# EAGLE design octanis_v0.4 (EAGLE 7.2.0)
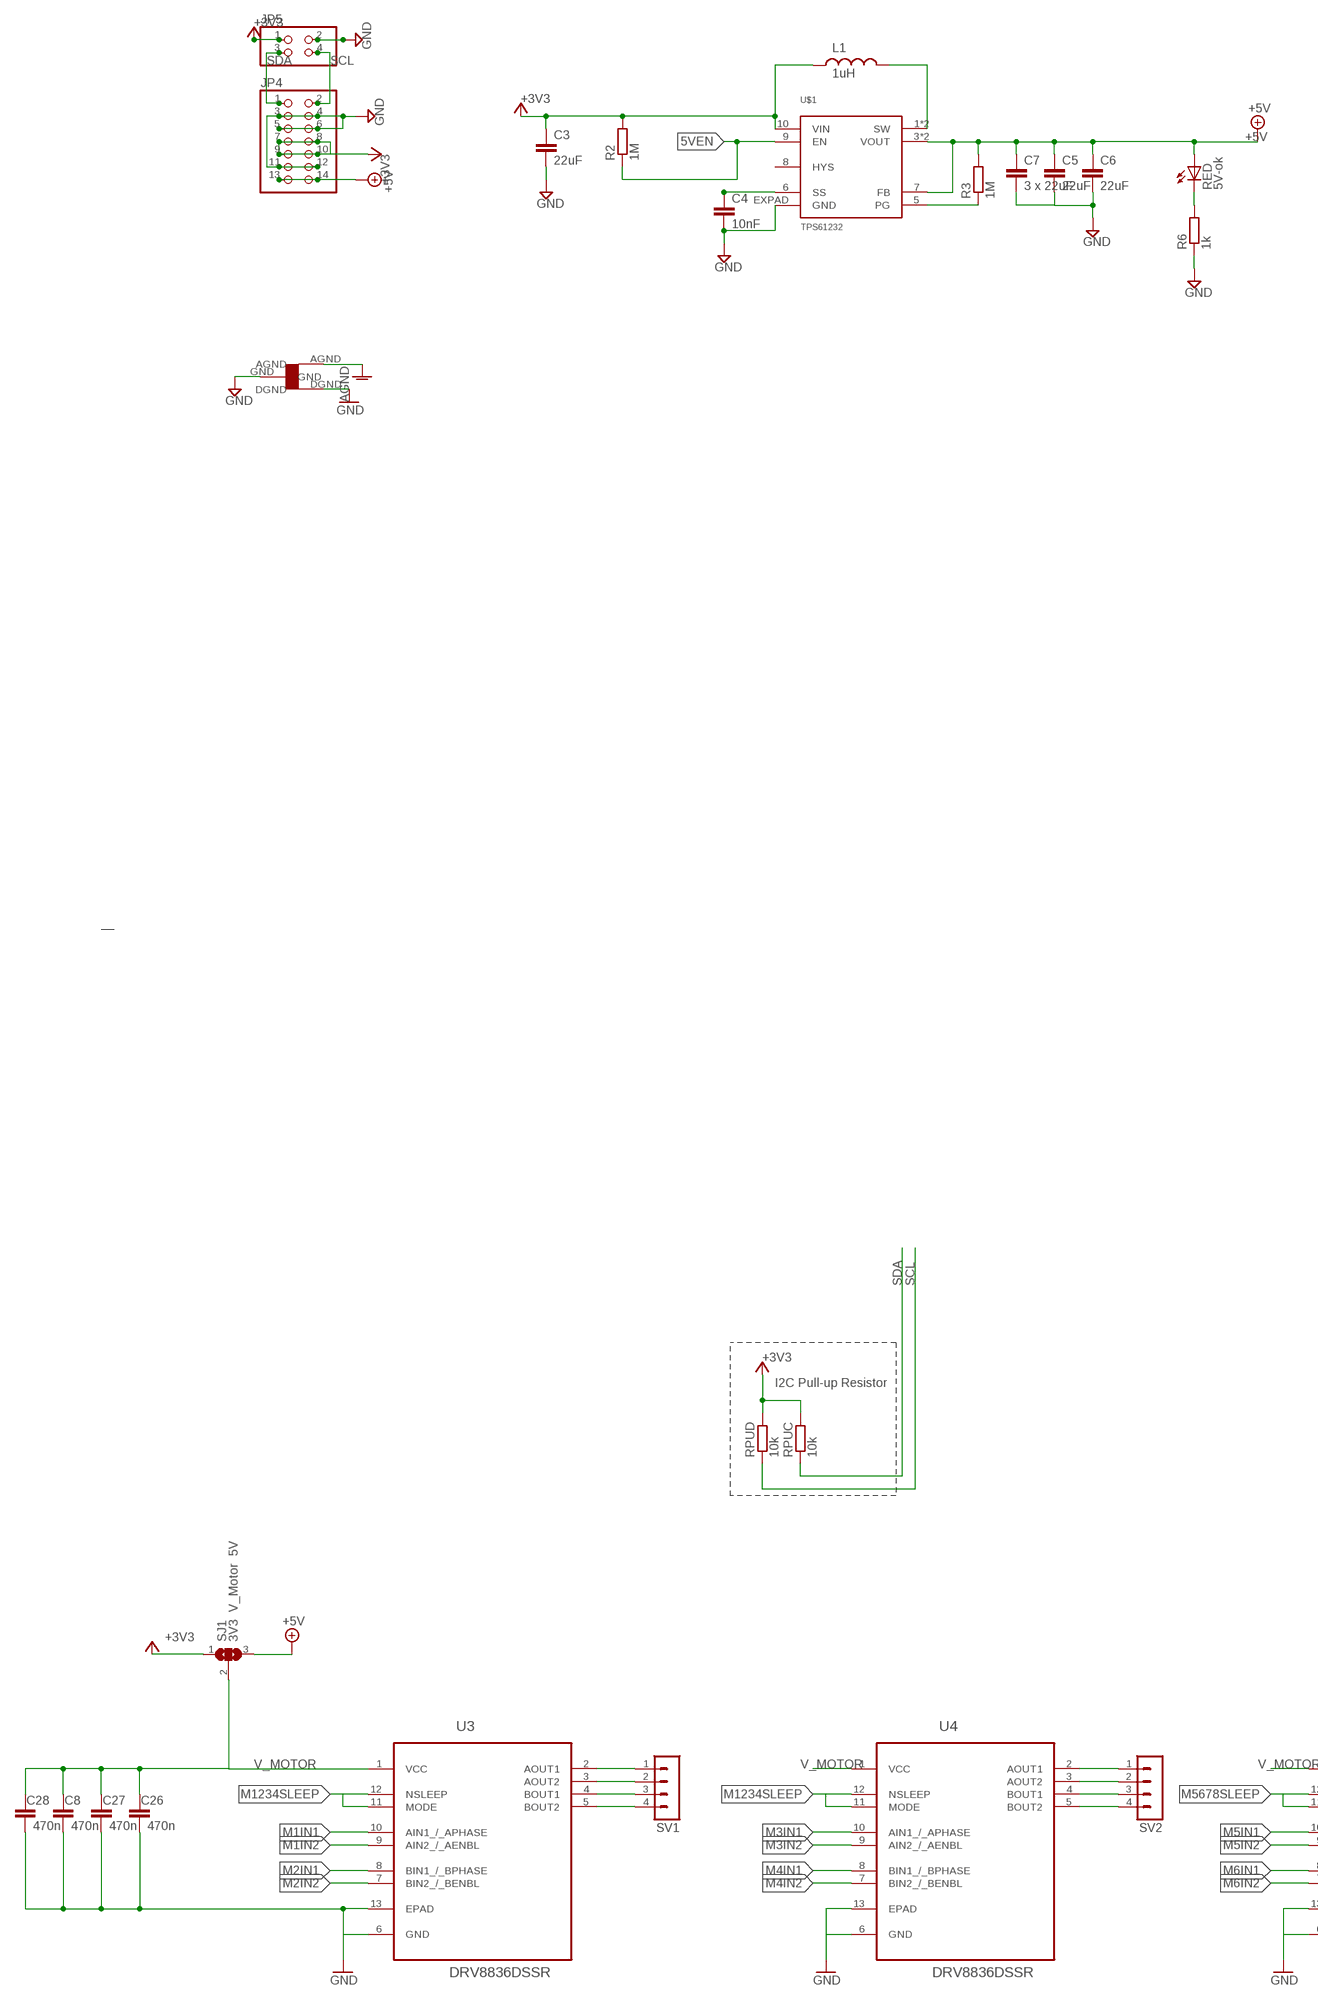
[diagram p0: schematic, sheet 1, part 1 of 3]
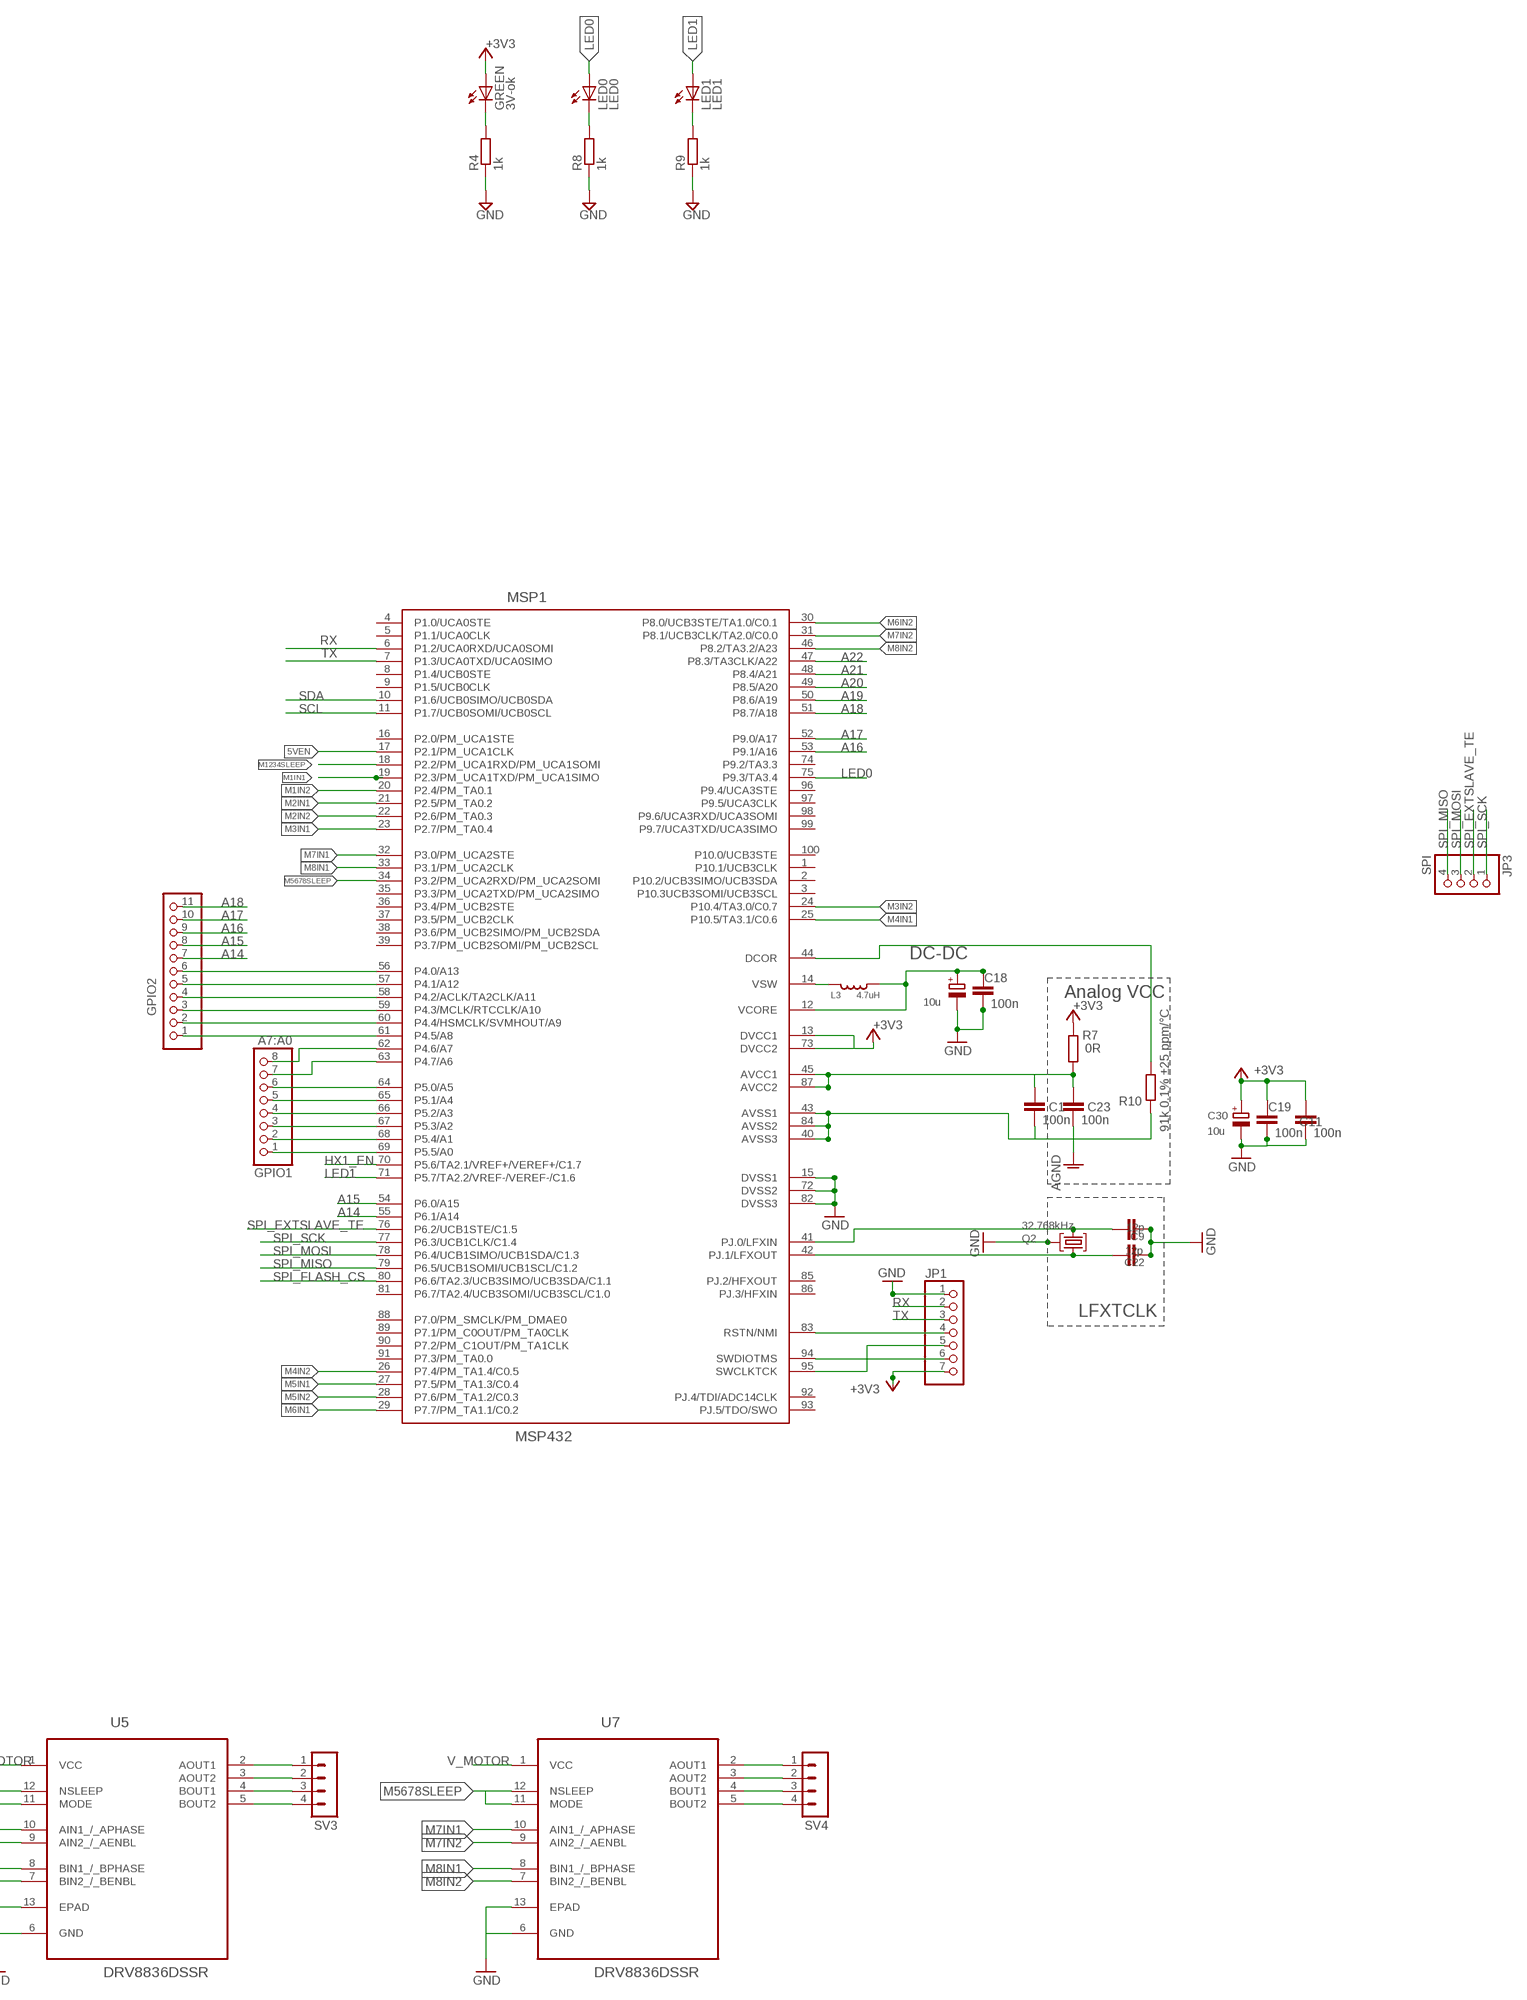
[diagram p1: schematic, sheet 1, part 2 of 3]
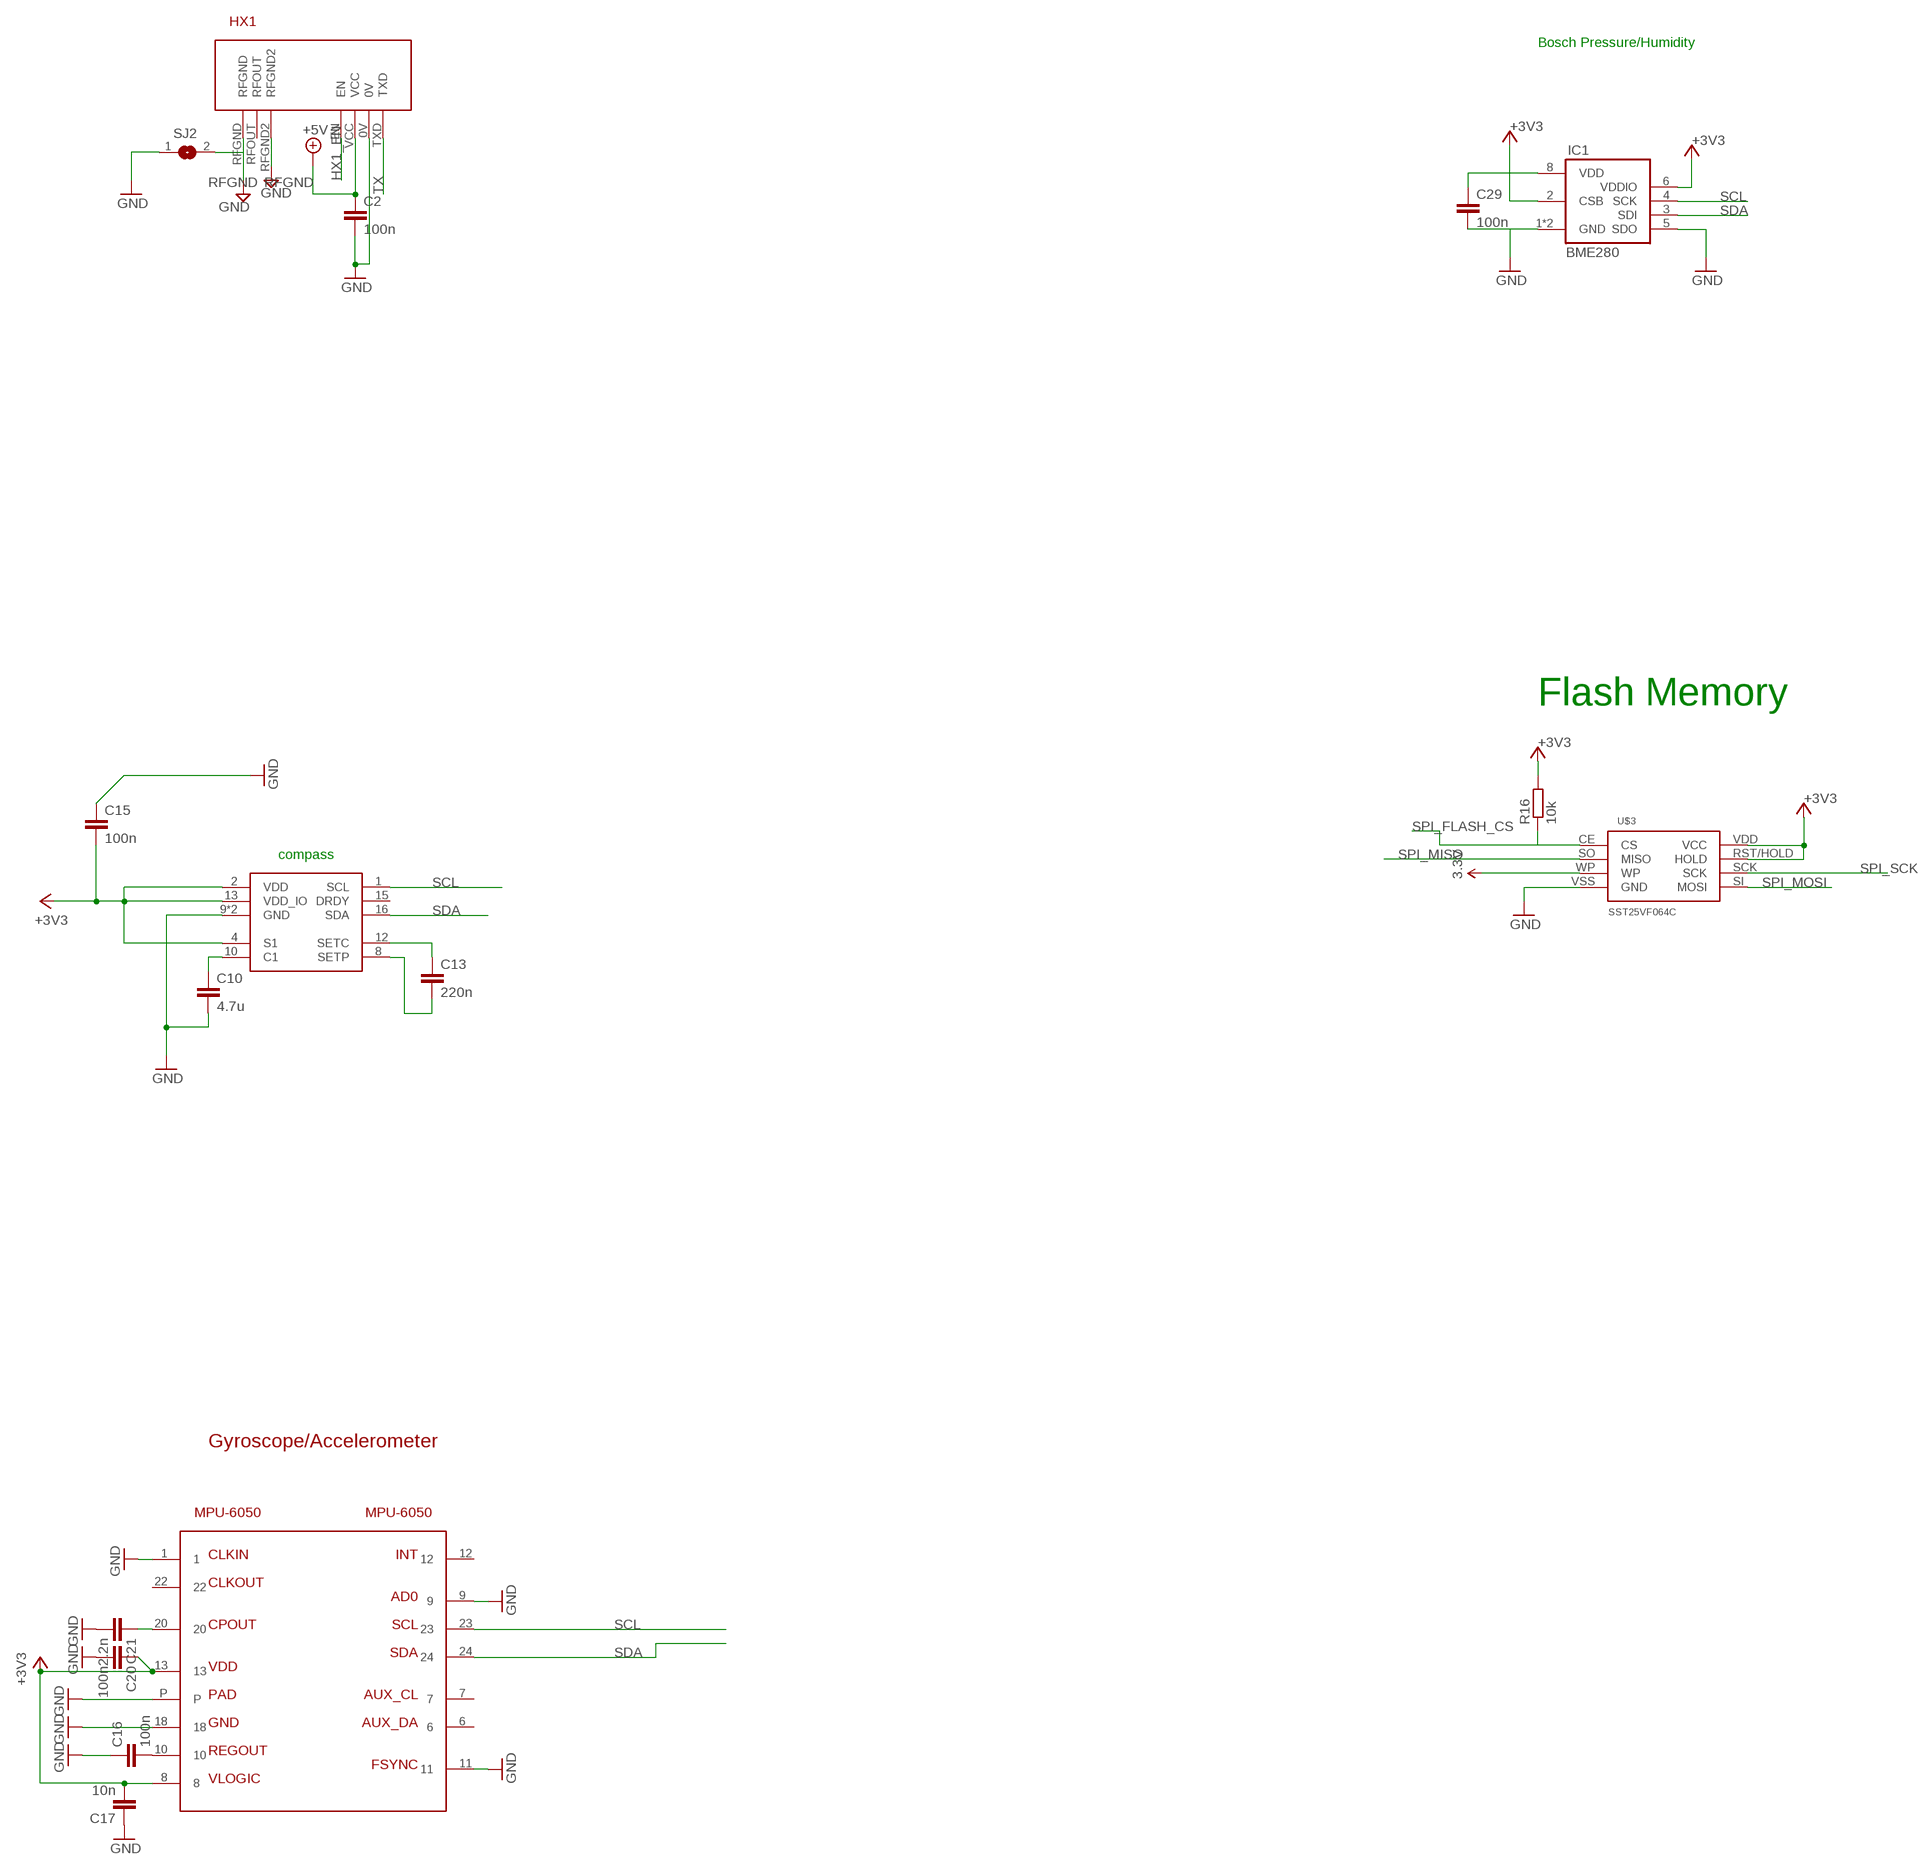
[diagram p2: schematic, sheet 1, part 3 of 3]

## Parts
C1  100n  C-EUC0402  [C0402]
C2  100n  C-EUC0603  [C0603]
C3  22uF  C-EUC0603  [C0603]
C4  10nF  C-EUC0603  [C0603]
C5  22uF  C-EUC0603  [C0603]
C6  22uF  C-EUC0603  [C0603]
C7  3 x 22uF  C-EUC0603  [C0603]
C8  470n  C-EUC0603  [C0603]
C9  12p  C-EUC0402  [C0402]
C10  4.7u  C-EUC0603  [C0603]
C11  100n  C-EUC0603  [C0603]
C13  220n  C-EUC0603  [C0603]
C15  100n  C-EUC0603  [C0603]
C16  100n  C-EUC0603  [C0603]
C17  10n  C-EUC0603  [C0603]
C18  100n  C-EUC0603  [C0603]
C19  100n  C-EUC0603  [C0603]
C20  100n  C-EUC0603  [C0603]
C21  2.2n  C-EUC0603  [C0603]
C22  12p  C-EUC0402  [C0402]
C23  100n  C-EUC0402  [C0402]
C25  10u  CPOL-EUA/3216-18R  [A/3216-18R]
C26  470n  C-EUC0603  [C0603]
C27  470n  C-EUC0603  [C0603]
C28  470n  C-EUC0603  [C0603]
C29  100n  C-EUC0603  [C0603]
C30  10u  CPOL-EUA/3216-18R  [A/3216-18R]
COMPASS  HMC5883L  HMC5883L  [LPCC16]
GPIO1  A7:A0  PINHD-1X8  [1X08]
GPIO2  A18:A8  PINHD-1X11  [1X11]
GREEN  3V-ok  LEDCHIPLED_0603  [CHIPLED_0603]
IC1  BME280  [BME280]
JP1  PINHD-1X72MM  [1:07X2MM]
JP3  SPI  PINHD-1X4  [1X04]
JP4  PINHD-2X7  [2X07]
JP5  PINHD-2X2  [2X02]
L1  1uH  XFL4020  [XFL4020]
L3  4.7uH  LQM2MP_G0  [0806]
LED0  LED0  LEDCHIPLED_0603  [CHIPLED_0603]
LED1  LED1  LEDCHIPLED_0603  [CHIPLED_0603]
MPU-6050  MPU-6050  [QFN24]
MSP1  MSP432  [PZ100]
Q2  32.768kHz  MS3V-T1R  [MS3V-T1R]
R2  1M  R-EU_R0603  [R0603]
R3  1M  R-EU_R0603  [R0603]
R4  1k  R-EU_R0603  [R0603]
R6  1k  R-EU_R0603  [R0603]
R7  0R  R-EU_R0402  [R0402]
R8  1k  R-EU_R0603  [R0603]
R9  1k  R-EU_R0603  [R0603]
R10  91k 0.1% ±25 ppm/°C  R-EU_R0402  [R0402]
R16  10k  R-EU_R0603  [R0603]
RED  5V-ok  LEDCHIPLED_0603  [CHIPLED_0603]
RPUC  10k  R-EU_R0603  [R0603]
RPUD  10k  R-EU_R0603  [R0603]
SJ1  3V3 V_Motor 5V  SJ2W  [SJ_2]
SJ2  SJ  [SJ]
SV1  MA04-1  [MA04-1]
SV2  MA04-1  [MA04-1]
SV3  MA04-1  [MA04-1]
SV4  MA04-1  [MA04-1]
U3  DRV8836DSSR  [SON50P200X300X80-13N]
U4  DRV8836DSSR  [SON50P200X300X80-13N]
U5  DRV8836DSSR  [SON50P200X300X80-13N]
U7  DRV8836DSSR  [SON50P200X300X80-13N]
U$1  TPS61232  [S-PVSON-N10]
U$2  STARGND  [STAR]
U$3  SST25VF064C  [SOIC_8-LEAD]
U$4  HX1  [HX1]

## Nets
3.3V [power]: U$3.WP
5VEN: MSP1.17(P2.1/PM_UCA1CLK) R2.1 U$1.9(EN)
+3V3 [power]: C3.1 C11.2 C15.2 C17.2 C19.2 C20.1 C29.1 C30.+ COMPASS.2(VDD) COMPASS.4(S1) COMPASS.13(VDD_IO) GREEN.A IC1.2(CSB) IC1.6(VDDIO) IC1.8(VDD) JP1.7 JP4.7 JP4.8 JP4.9 JP4.10 JP5.1 L1.P$1 MPU-6050.8 MPU-6050.13 MSP1.13(DVCC1) MSP1.73(DVCC2) R2.2 R7.2 R16.2 RPUC.2 RPUD.2 SJ1.1 U$1.10(VIN) U$3.RST/HOLD(HOLD) U$3.VDD(VCC)
+5V [fine]: C2.1 C5.1 C6.1 C7.1 JP4.13 JP4.14 R3.2 RED.A SJ1.3 U$1.3(VOUT) U$1.4(VOUT) U$1.7(FB) U$4.VCC
A14: GPIO2.7 MSP1.55(P6.1/A14)
A15: GPIO2.8 MSP1.54(P6.0/A15)
A16: GPIO2.9 MSP1.53(P9.1/A16)
A17: GPIO2.10 MSP1.52(P9.0/A17)
A18: GPIO2.11 MSP1.51(P8.7/A18)
A19: MSP1.50(P8.6/A19)
A20: MSP1.49(P8.5/A20)
A21: MSP1.48(P8.4/A21)
A22: MSP1.47(P8.3/TA3CLK/A22)
AGND [power]: C1.2 C23.2 MSP1.40(AVSS3) MSP1.43(AVSS1) MSP1.84(AVSS2) R10.2 U$2.AGND
AVCC1 [VIN]: C1.1 C23.1 MSP1.45(AVCC1) MSP1.87(AVCC2) R7.1
GND [power]: C2.2 C3.2 C4.2 C5.2 C6.2 C7.2 C8.1 C9.1 C10.2 C11.1 C15.1 C16.1 C17.1 C18.1 C19.1 C20.2 C21.2 C22.1 C25.- C26.1 C27.1 C28.1 C29.2 C30.- COMPASS.9(GND) COMPASS.11(GND) IC1.1(GND) IC1.5(SDO) IC1.7(GND) JP1.1 JP4.3 JP4.4 JP4.5 JP4.6 JP4.11 JP4.12 JP5.2 MPU-6050.1 MPU-6050.9 MPU-6050.11 MPU-6050.18 MPU-6050.P MSP1.15(DVSS1) MSP1.72(DVSS2) MSP1.82(DVSS3) Q2.P3(GND) R4.1 R6.1 R8.1 R9.1 SJ2.1 U3.6(GND) U3.13(EPAD) U4.6(GND) U4.13(EPAD) U5.6(GND) U5.13(EPAD) U7.6(GND) U7.13(EPAD) U$1.EXPAD(GND) U$2.DGND U$2.GND U$3.VSS(GND) U$4.0V
HX1_EN: MSP1.70(P5.6/TA2.1/VREF+/VEREF+/C1.7) U$4.EN
IND: L1.P$2 U$1.1(SW) U$1.2(SW)
LED0: LED0.A MSP1.75(P9.3/TA3.4)
LED1: LED1.A MSP1.71(P5.7/TA2.2/VREF-/VEREF-/C1.6)
M1IN1: MSP1.19(P2.3/PM_UCA1TXD/PM_UCA1SIMO) U3.10(AIN1_/_APHASE)
M1IN2: MSP1.20(P2.4/PM_TA0.1) U3.9(AIN2_/_AENBL)
M2IN1: MSP1.21(P2.5/PM_TA0.2) U3.8(BIN1_/_BPHASE)
M2IN2: MSP1.22(P2.6/PM_TA0.3) U3.7(BIN2_/_BENBL)
M3IN1: MSP1.23(P2.7/PM_TA0.4) U4.10(AIN1_/_APHASE)
M3IN2: MSP1.24(P10.4/TA3.0/C0.7) U4.9(AIN2_/_AENBL)
M4IN1: MSP1.25(P10.5/TA3.1/C0.6) U4.8(BIN1_/_BPHASE)
M4IN2: MSP1.26(P7.4/PM_TA1.4/C0.5) U4.7(BIN2_/_BENBL)
M5IN1: MSP1.27(P7.5/PM_TA1.3/C0.4) U5.10(AIN1_/_APHASE)
M5IN2: MSP1.28(P7.6/PM_TA1.2/C0.3) U5.9(AIN2_/_AENBL)
M6IN1: MSP1.29(P7.7/PM_TA1.1/C0.2) U5.8(BIN1_/_BPHASE)
M6IN2: MSP1.30(P8.0/UCB3STE/TA1.0/C0.1) U5.7(BIN2_/_BENBL)
M7IN1: MSP1.32(P3.0/PM_UCA2STE) U7.10(AIN1_/_APHASE)
M7IN2: MSP1.31(P8.1/UCB3CLK/TA2.0/C0.0) U7.9(AIN2_/_AENBL)
M8IN1: MSP1.33(P3.1/PM_UCA2CLK) U7.8(BIN1_/_BPHASE)
M8IN2: MSP1.46(P8.2/TA3.2/A23) U7.7(BIN2_/_BENBL)
M1234SLEEP: MSP1.18(P2.2/PM_UCA1RXD/PM_UCA1SOMI) U3.11(MODE) U3.12(NSLEEP) U4.11(MODE) U4.12(NSLEEP)
M5678SLEEP: MSP1.34(P3.2/PM_UCA2RXD/PM_UCA2SOMI) U5.11(MODE) U5.12(NSLEEP) U7.11(MODE) U7.12(NSLEEP)
N$1: C18.2 C25.+ L3.1 MSP1.12(VCORE)
N$2: R3.1 U$1.5(PG)
N$4: GREEN.C R4.2
N$5: LED0.C R8.2
N$6: LED1.C R9.2
N$8: C22.2 MSP1.41(PJ.0/LFXIN) Q2.P2
N$10: C9.2 MSP1.42(PJ.1/LFXOUT) Q2.P1
N$13: SV2.1 U4.2(AOUT1)
N$14: GPIO2.1 MSP1.61(P4.5/A8)
N$15: GPIO2.2 MSP1.60(P4.4/HSMCLK/SVMHOUT/A9)
N$17: C10.1 COMPASS.10(C1)
N$18: C16.2 MPU-6050.10
N$19: C21.1 MPU-6050.20
N$20: GPIO2.3 MSP1.59(P4.3/MCLK/RTCCLK/A10)
N$21: GPIO2.4 MSP1.58(P4.2/ACLK/TA2CLK/A11)
N$22: GPIO2.5 MSP1.57(P4.1/A12)
N$23: GPIO2.6 MSP1.56(P4.0/A13)
N$25: C13.2 COMPASS.8(SETP)
N$27: GPIO1.1 MSP1.69(P5.5/A0)
N$28: GPIO1.2 MSP1.68(P5.4/A1)
N$30: GPIO1.3 MSP1.67(P5.3/A2)
N$32: C13.1 COMPASS.12(SETC)
N$33: MSP1.44(DCOR) R10.1
N$34: L3.2 MSP1.14(VSW)
N$35: GPIO1.4 MSP1.66(P5.2/A3)
N$36: GPIO1.5 MSP1.65(P5.1/A4)
N$37: GPIO1.6 MSP1.64(P5.0/A5)
N$38: GPIO1.8 MSP1.62(P4.6/A7)
N$39: SV2.2 U4.3(AOUT2)
N$40: SV2.3 U4.4(BOUT1)
N$41: SV2.4 U4.5(BOUT2)
N$42: C4.1 U$1.6(SS)
N$43: GPIO1.7 MSP1.63(P4.7/A6)
N$44: R6.2 RED.C
N$45: SV3.1 U5.2(AOUT1)
N$46: SV3.2 U5.3(AOUT2)
N$47: SV3.3 U5.4(BOUT1)
N$48: SV3.4 U5.5(BOUT2)
N$49: SV1.1 U3.2(AOUT1)
N$50: SV1.2 U3.3(AOUT2)
N$51: SV1.3 U3.4(BOUT1)
N$52: SV1.4 U3.5(BOUT2)
N$53: SV4.1 U7.2(AOUT1)
N$54: SV4.2 U7.3(AOUT2)
N$55: SV4.3 U7.4(BOUT1)
N$56: SV4.4 U7.5(BOUT2)
N$75: JP1.4 MSP1.83(RSTN/NMI)
N$76: JP1.6 MSP1.94(SWDIOTMS)
N$77: JP1.5 MSP1.95(SWCLKTCK)
RFGND [power]: SJ2.2 U$4.RFGND U$4.RFGND2 ; supply symbol labelled GND
RX: JP1.2 MSP1.6(P1.2/UCA0RXD/UCA0SOMI)
SCL: COMPASS.1(SCL) IC1.4(SCK) JP4.2 JP5.4 MPU-6050.23 MSP1.11(P1.7/UCB0SOMI/UCB0SCL) RPUD.1
SDA: COMPASS.16(SDA) IC1.3(SDI) JP4.1 JP5.3 MPU-6050.24 MSP1.10(P1.6/UCB0SIMO/UCB0SDA) RPUC.1
SPI_EXTSLAVE_TE: JP3.2 MSP1.76(P6.2/UCB1STE/C1.5)
SPI_FLASH_CS: MSP1.80(P6.6/TA2.3/UCB3SIMO/UCB3SDA/C1.1) R16.1 U$3.CE(CS)
SPI_MISO: JP3.4 MSP1.79(P6.5/UCB1SOMI/UCB1SCL/C1.2) U$3.SO(MISO)
SPI_MOSI: JP3.3 MSP1.78(P6.4/UCB1SIMO/UCB1SDA/C1.3) U$3.SI(MOSI)
SPI_SCK: JP3.1 MSP1.77(P6.3/UCB1CLK/C1.4) U$3.SCK
TX: JP1.3 MSP1.7(P1.3/UCA0TXD/UCA0SIMO) U$4.TXD
V_MOTOR [fine]: C8.2 C26.2 C27.2 C28.2 SJ1.2 U3.1(VCC) U4.1(VCC) U5.1(VCC) U7.1(VCC)
Unconnected: COMPASS.15(DRDY) MPU-6050.6 MPU-6050.7 MPU-6050.12 MPU-6050.22 U$1.8(HYS) U$4.RFOUT

## Notes on the sheet
- Bosch Pressure/Humidity
- Flash Memory
- compass
- DC-DC
- Analog VCC
- LFXTCLK
- Gyroscope/Accelerometer
- I2C Pull-up Resistor

## Power pins joined to a net without a drawn wire
P1.0/UCA0STE: MSP1.4(P1.0/UCA0STE)
P1.1/UCA0CLK: MSP1.5(P1.1/UCA0CLK)
P1.4/UCB0STE: MSP1.8(P1.4/UCB0STE)
P1.5/UCB0CLK: MSP1.9(P1.5/UCB0CLK)
P2.0/PM_UCA1STE: MSP1.16(P2.0/PM_UCA1STE)
P3.3/PM_UCA2TXD/PM_UCA2SIMO: MSP1.35(P3.3/PM_UCA2TXD/PM_UCA2SIMO)
P3.4/PM_UCB2STE: MSP1.36(P3.4/PM_UCB2STE)
P3.5/PM_UCB2CLK: MSP1.37(P3.5/PM_UCB2CLK)
P3.6/PM_UCB2SIMO/PM_UCB2SDA: MSP1.38(P3.6/PM_UCB2SIMO/PM_UCB2SDA)
P3.7/PM_UCB2SOMI/PM_UCB2SCL: MSP1.39(P3.7/PM_UCB2SOMI/PM_UCB2SCL)
P6.7/TA2.4/UCB3SOMI/UCB3SCL/C1.0: MSP1.81(P6.7/TA2.4/UCB3SOMI/UCB3SCL/C1.0)
P7.0/PM_SMCLK/PM_DMAE0: MSP1.88(P7.0/PM_SMCLK/PM_DMAE0)
P7.1/PM_C0OUT/PM_TA0CLK: MSP1.89(P7.1/PM_C0OUT/PM_TA0CLK)
P7.2/PM_C1OUT/PM_TA1CLK: MSP1.90(P7.2/PM_C1OUT/PM_TA1CLK)
P7.3/PM_TA0.0: MSP1.91(P7.3/PM_TA0.0)
P9.2/TA3.3: MSP1.74(P9.2/TA3.3)
P9.4/UCA3STE: MSP1.96(P9.4/UCA3STE)
P9.5/UCA3CLK: MSP1.97(P9.5/UCA3CLK)
P9.6/UCA3RXD/UCA3SOMI: MSP1.98(P9.6/UCA3RXD/UCA3SOMI)
P9.7/UCA3TXD/UCA3SIMO: MSP1.99(P9.7/UCA3TXD/UCA3SIMO)
P10.0/UCB3STE: MSP1.100(P10.0/UCB3STE)
P10.1/UCB3CLK: MSP1.1(P10.1/UCB3CLK)
P10.2/UCB3SIMO/UCB3SDA: MSP1.2(P10.2/UCB3SIMO/UCB3SDA)
P10.3UCB3SOMI/UCB3SCL: MSP1.3(P10.3UCB3SOMI/UCB3SCL)
PJ.2/HFXOUT: MSP1.85(PJ.2/HFXOUT)
PJ.3/HFXIN: MSP1.86(PJ.3/HFXIN)
PJ.4/TDI/ADC14CLK: MSP1.92(PJ.4/TDI/ADC14CLK)
PJ.5/TDO/SWO: MSP1.93(PJ.5/TDO/SWO)

## Library data of the parts
C1-C11 C13 C15-C23 C26-C29 = rcl:C-EU: CAPACITOR, European symbol
C25 C30 = rcl:CPOL-EU: POLARIZED CAPACITOR, European symbol
COMPASS = HMC5883L:HMC5883L
GPIO1 = pinhead:PINHD-1X8: PIN HEADER
GPIO2 = pinhead:PINHD-1X11: PIN HEADER
GREEN LED0 LED1 RED = adafruit:LED: LED OSRAM: - CHIPLED LG R971, LG N971, LY N971, LG Q971, LY Q971, LO R971, LY R971 LH N974, LH R974 LS Q976, LO Q976, LY Q976 LO Q996 - Hyper CHIPLED LW Q18S LB Q993, LB Q99A, LB R99A - SideLED LS A670, LO A670, LY A670, LG A670, LP A670 LB A673, LV A673, LT A673, LW A673 LH A674 LY A675 LS A676, LA A676, LO A676, LY A676, LW A676 LS A679, LY A679, LG A679 - Hyper Micro SIDELED® LS Y876, LA Y876, LO Y876, LY Y876 LT Y87S - SmartLED LW L88C, LW L88S LB L89C, LB L89S, LG L890 LS L89K, LO L89K, LY L89K LS L896, LA L896, LO L896, LY L896 - TOPLED LS T670, LO T670, LY T670, LG T670, LP T670 LSG T670, LSP T670, LSY T670, LOP T670, LYG T670 LG T671, LOG T671, LSG T671 LB T673, LV T673, LT T673, LW T673 LH T674 LS T676, LA T676, LO T676, LY T676, LB T676, LH T676, LSB T676, LW T676 LB T67C, LV T67C, LT T67C, LS T67K, LO T67K, LY T67K, LW E67C LS E67B, LA E67B, LO E67B, LY E67B, LB E67C, LV E67C, LT E67C LW T67C LS T679, LY T679, LG T679 LS T770, LO T770, LY T770, LG T770, LP T770 LB T773, LV T773, LT T773, LW T773 LH T774 LS E675, LA E675, LY E675, LS T675 LS T776, LA T776, LO T776, LY T776, LB T776 LHGB T686 LT T68C, LB T68C - Hyper Mini TOPLED® LB M676 - Mini TOPLED Santana® LG M470 LS M47K, LO M47K, LY M47K Source: http://www.osram.convergy.de/
IC1 = bosch-bme280:BME280: DIGITAL HUMIDITY, PRESSURE AND TEMPERATURE SENSOR * Digital interface I²C (up to 3.4 MHz) and SPI (3 and 4 wire, up to 10 MHz)* Supply voltage VDD main supply voltage range: 1.71 V to 3.6 V*VDDIO interface voltage range: 1.2 V to 3.6 V Operating range -40…+85 °C, 0…100 % rel. humidity, 300…1100 hPa The library has been designed by Richard Magdycz <https://www.facebook.com/groups/eaglecadsoftUK>
JP1 = Headerlibrary:PINHD-1X7: PIN HEADER
JP3 = pinhead:PINHD-1X4: PIN HEADER
JP4 = pinhead:PINHD-2X7: PIN HEADER
JP5 = pinhead:PINHD-2X2: PIN HEADER
L1 = Coilcraft:XFL4020
L3 = Murata:LQM2MP_G0
MPU-6050 = seb:MPU-6050
MSP1 = MSP-EXP432:MSP432
Q2 = microcrystal:MS3V-T1R
R2-R4 R6-R10 R16 RPUC RPUD = rcl:R-EU_: RESISTOR, European symbol
SJ1 = jumper:SJ2W: SMD solder JUMPER
SJ2 = jumper:SJ: SMD solder JUMPER
SV1-SV4 = con-lstb:MA04-1: PIN HEADER; OC_FARNELL: unknown; OC_NEWARK: unknown
U3-U5 U7 = DRV8834:DRV8836DSSR: DUAL LOW VOLTAGE H-BRIDGE IC,SON-12; MPN: DRV8836DSSR; OC_FARNELL: 2115236; OC_NEWARK: 94T6066; PACKAGE: SON-12; SUPPLIER: TEXAS INSTRUMENTS
U$1 = texasinstruments:TPS61232: Up to 96% Efficiency Synchronous Boost Converter 3.3 V to 5 V Power Conversion with 2.1 A Output Current Input Supply Voltage Supervisor with Adjustable Threshold/ Hysteresis Power Save Mode for Light Load Efficiency Load Disconnect During Shutdown Output Over Voltage Protection Programmable Soft Start Power Good Output Input Voltage Range: 2.3 V to 5.5 V Output Voltage Range: 2.5 V to 5.5 V 2 MHz Switching Frequency Output Capacitor Discharge (TPS61231) 3 mm × 3 mm × 0.9 mm SON Package
U$2 = lpatiny:STARGND
U$3 = BertaLib:SST25VF064C
U$4 = Octanis1:HX1: Radiometrix HX1: VHF Narrow Band FM 300mW Transmitter. HX1-144.390-3

## Net classes
0 default: width 0.254 mm
1 power: width 0.203 mm, drill 0.305 mm, clearance 0.152 mm
2 VIN: width 0.203 mm, drill 0.305 mm, clearance 0.152 mm
3 fine: width 0.406 mm, drill 0.61 mm, clearance 0.152 mm

## Board
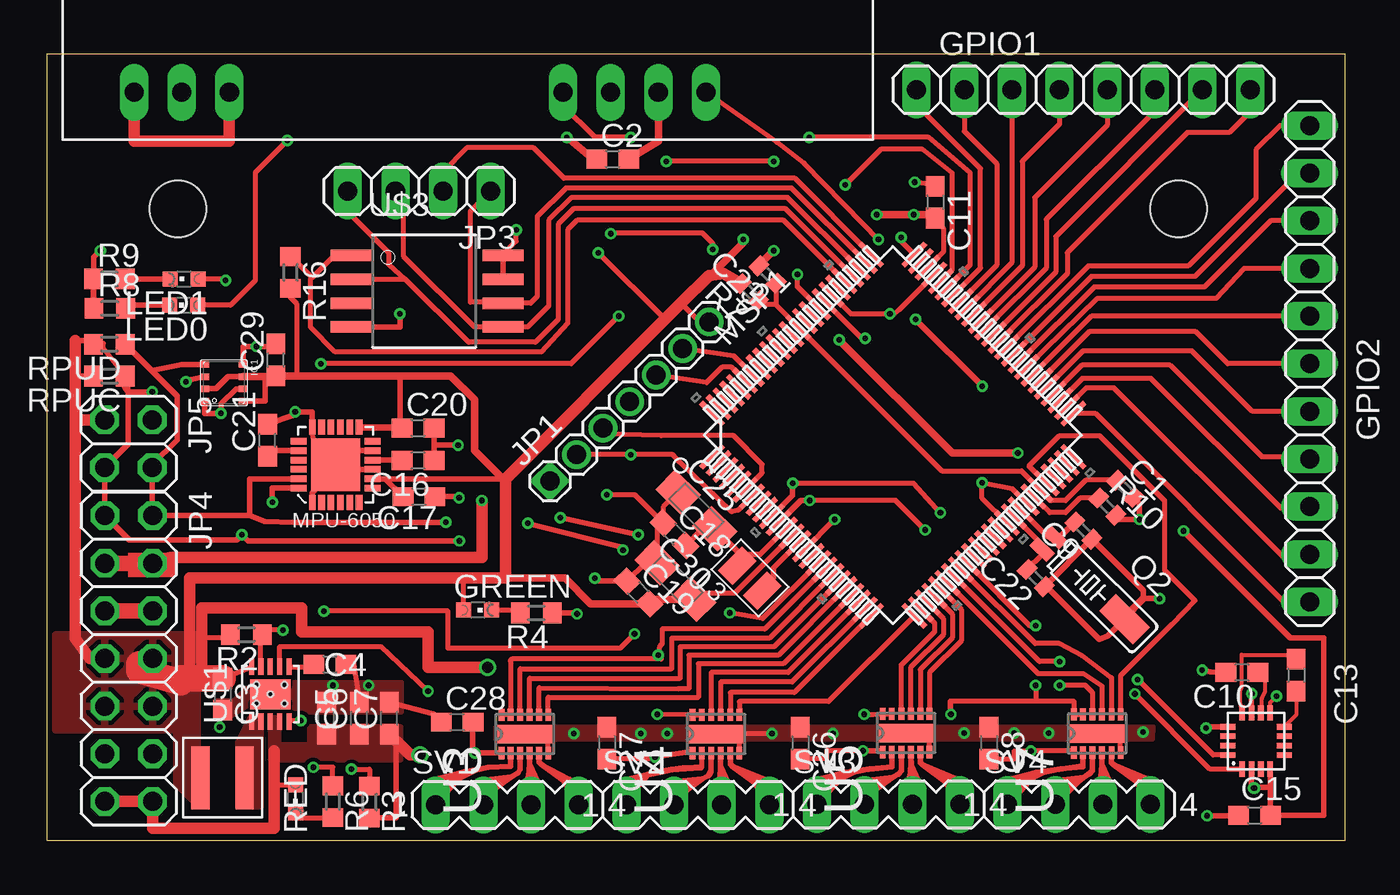
[diagram p3: board, top side]
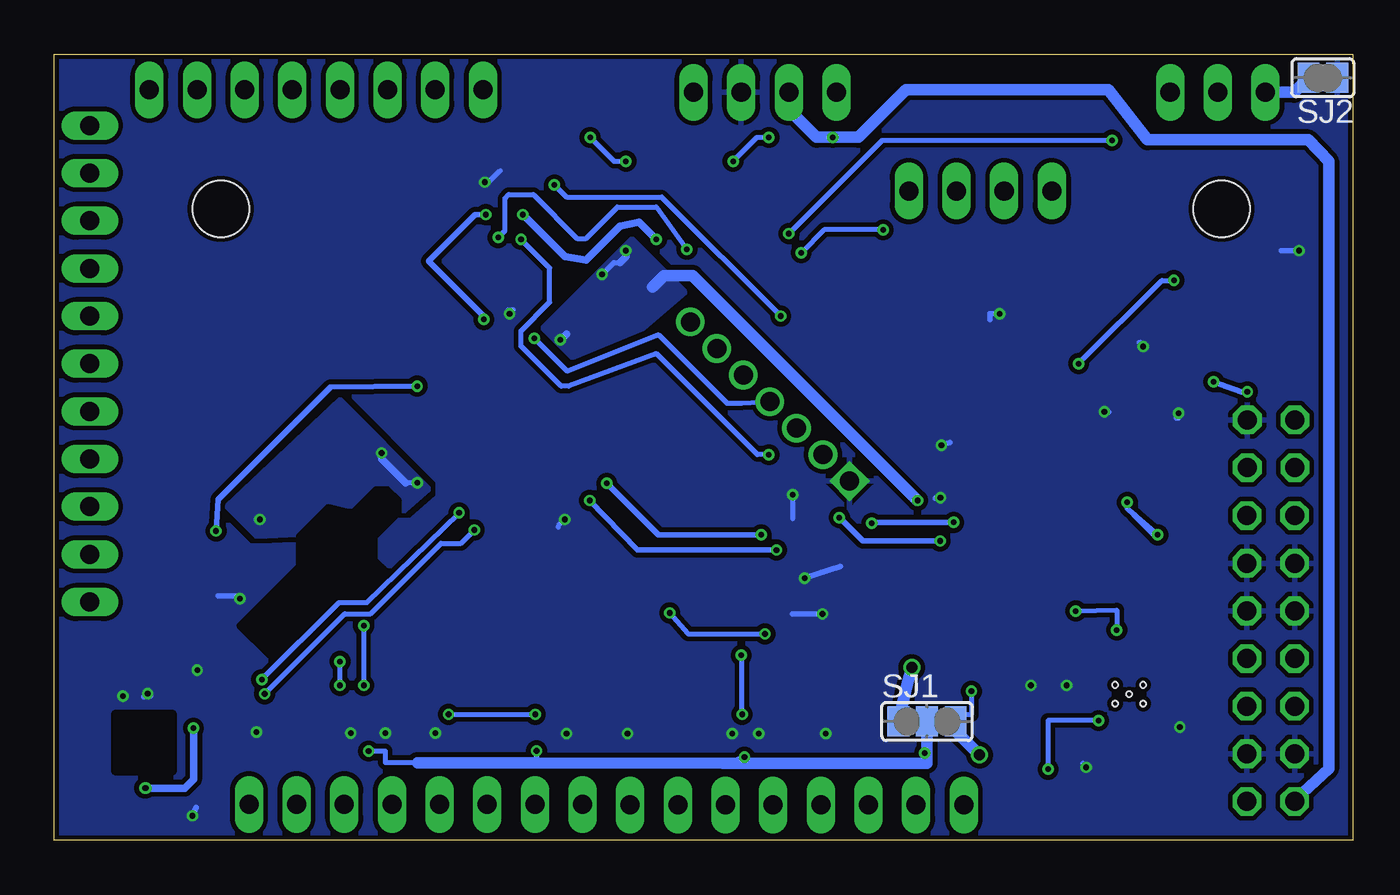
[diagram p4: board, bottom side, seen from below]

Size 69.22 x 41.91 mm. Coordinates in mm from the lower left corner, seen from the top.
Outline: 0,0 69.22,0 69.22,41.91 0,41.91 0,0
Copper layers (1*16): Top 0.035mm / dielectric 1.5mm / Bottom 0.035mm
Design rules "SeeedStudio_2layer_DRU_no_angle_20140221 *": minimum track width 8mil, minimum drill 12mil, track to track 8mil, track to pad 8mil, pad to pad 6mil, via to via 8mil, smd to smd 0mil, copper to edge 10mil, drill to drill 10mil, minimum pad ring 10mil, minimum via ring 6mil, stop-mask expansion 2mil, vias tented up to drill 100mil, thermal gap 10mil
Holes 3 mm at 6.98,33.66 60.32,33.66
bRestrict: area 62.9,3.7 to 65.9,6.7

### Footprints (pad centres in the part's own frame; a part is rotated, then mirrored left to right if it is on the bottom)
C0402 = smd 0.7 x 0.9: 1 -0.65,0; 2 0.65,0
C0603 = smd 1.1 x 1: 1 -0.85,0; 2 0.85,0
A/3216-18R = smd 1.95 x 1.5: + 1.375,0; - -1.375,0
LPCC16 = smd 0.8 x 0.3: 1 -1.5,0.75; 2 -1.5,0.25; 3 -1.5,-0.25; 4 -1.5,-0.75; 9 1.5,-0.75; 10 1.5,-0.25; 11 1.5,0.25; 12 1.5,0.75 | smd 0.3 x 0.8: 5 -0.75,-1.5; 6 -0.25,-1.5; 7 0.25,-1.5; 8 0.75,-1.5; 13 0.75,1.5; 14 0.25,1.5; 15 -0.25,1.5; 16 -0.75,1.5
1X08 = drill 1.016 long: 1 -8.89,0; 2 -6.35,0; 3 -3.81,0; 4 -1.27,0; 5 1.27,0; 6 3.81,0; 7 6.35,0; 8 8.89,0
1X11 = drill 1.016 long: 1 -12.7,0; 2 -10.16,0; 3 -7.62,0; 4 -5.08,0; 5 -2.54,0; 6 0,0; 7 2.54,0; 8 5.08,0; 9 7.62,0; 10 10.16,0; 11 12.7,0
CHIPLED_0603 = smd 0.8 x 0.8: A 0,-0.75; C 0,0.75
BME280 = smd 0.35 x 0.5: 1 0.975,-1.025; 2 0.325,-1.025; 3 -0.325,-1.025; 4 -0.975,-1.025; 5 -0.975,1.025; 6 -0.325,1.025; 7 0.325,1.025; 8 0.975,1.025
1:07X2MM = drill 1.016 pad 1.3 square: 1 0,0 | drill 1.016 pad 1.3: 2 4,0; 3 2,0; 4 6,0; 5 8,0; 6 10,0; 7 12,0
1X04 = drill 1.016 long: 1 -3.81,0; 2 -1.27,0; 3 1.27,0; 4 3.81,0
2X07 = drill 1.016 octagon: 1 -7.62,-1.27; 2 -7.62,1.27; 3 -5.08,-1.27; 4 -5.08,1.27; 5 -2.54,-1.27; 6 -2.54,1.27; 7 0,-1.27; 8 0,1.27; 9 2.54,-1.27; 10 2.54,1.27; 11 5.08,-1.27; 12 5.08,1.27; 13 7.62,-1.27; 14 7.62,1.27
2X02 = drill 1.016 octagon: 1 -1.27,-1.27; 2 -1.27,1.27; 3 1.27,-1.27; 4 1.27,1.27
XFL4020 = smd 0.965 x 3.353: P$1 -1.181,0; P$2 1.181,0
0806 = smd 1.1 x 1.8: 1 -0.94,0; 2 0.94,0
QFN24 = smd 0.8 x 0.35: 1 -2,1.25; 2 -2,0.75; 3 -2,0.25; 4 -2,-0.25; 5 -2,-0.75; 6 -2,-1.25; 13 2,-1.25; 14 2,-0.75; 15 2,-0.25; 16 2,0.25; 17 2,0.75; 18 2,1.25 | smd 0.35 x 0.85: 7 -1.25,-1.975; 8 -0.75,-1.975; 9 -0.25,-1.975; 10 0.25,-1.975; 11 0.75,-1.975; 12 1.25,-1.975; 19 1.25,1.975; 20 0.75,1.975; 21 0.25,1.975; 22 -0.25,1.975; 23 -0.75,1.975; 24 -1.25,1.975 | smd 2.8 x 2.6: P 0,0
PZ100 = smd 1.676 x 0.279: 1 -7.62,5.994; 2 -7.62,5.512; 3 -7.62,5.004; 4 -7.62,4.496; 5 -7.62,3.988; 6 -7.62,3.505; 7 -7.62,2.997; 8 -7.62,2.489; 9 -7.62,2.007; 10 -7.62,1.499; 11 -7.62,0.991; 12 -7.62,0.508; 13 -7.62,0; 14 -7.62,-0.508; 15 -7.62,-0.991; 16 -7.62,-1.499; 17 -7.62,-2.007; 18 -7.62,-2.489; 19 -7.62,-2.997; 20 -7.62,-3.505; 21 -7.62,-3.988; 22 -7.62,-4.496; 23 -7.62,-5.004; 24 -7.62,-5.512; 25 -7.62,-5.994; 51 7.62,-5.994; 52 7.62,-5.512; 53 7.62,-5.004; 54 7.62,-4.496; 55 7.62,-3.988; 56 7.62,-3.505; 57 7.62,-2.997; 58 7.62,-2.489; 59 7.62,-2.007; 60 7.62,-1.499; 61 7.62,-0.991; 62 7.62,-0.508; 63 7.62,0; 64 7.62,0.508; 65 7.62,0.991; 66 7.62,1.499; 67 7.62,2.007; 68 7.62,2.489; 69 7.62,2.997; 70 7.62,3.505; 71 7.62,3.988; 72 7.62,4.496; 73 7.62,5.004; 74 7.62,5.512; 75 7.62,5.994 | smd 0.279 x 1.676: 26 -5.994,-7.62; 27 -5.512,-7.62; 28 -5.004,-7.62; 29 -4.496,-7.62; 30 -3.988,-7.62; 31 -3.505,-7.62; 32 -2.997,-7.62; 33 -2.489,-7.62; 34 -2.007,-7.62; 35 -1.499,-7.62; 36 -0.991,-7.62; 37 -0.508,-7.62; 38 0,-7.62; 39 0.508,-7.62; 40 0.991,-7.62; 41 1.499,-7.62; 42 2.007,-7.62; 43 2.489,-7.62; 44 2.997,-7.62; 45 3.505,-7.62; 46 3.988,-7.62; 47 4.496,-7.62; 48 5.004,-7.62; 49 5.512,-7.62; 50 5.994,-7.62; 76 5.994,7.62; 77 5.512,7.62; 78 5.004,7.62; 79 4.496,7.62; 80 3.988,7.62; 81 3.505,7.62; 82 2.997,7.62; 83 2.489,7.62; 84 2.007,7.62; 85 1.499,7.62; 86 0.991,7.62; 87 0.508,7.62; 88 0,7.62; 89 -0.508,7.62; 90 -0.991,7.62; 91 -1.499,7.62; 92 -2.007,7.62; 93 -2.489,7.62; 94 -2.997,7.62; 95 -3.505,7.62; 96 -3.988,7.62; 97 -4.496,7.62; 98 -5.004,7.62; 99 -5.512,7.62; 100 -5.994,7.62
MS3V-T1R = smd 0.635 x 1.27: P1 -0.47,-4.43; P2 0.47,-4.43 | smd 1.27 x 2.54: P3 0,1.3
R0603 = smd 1 x 1.1: 1 -0.85,0; 2 0.85,0
R0402 = smd 0.7 x 0.9: 1 -0.65,0; 2 0.65,0
SJ_2 = smd 1.168 x 1.6: 1 -1.524,0; 2 0,0; 3 1.524,0
SJ = smd 1.168 x 1.6: 1 -0.762,0; 2 0.762,0
MA04-1 = drill 1.016 long: 1 -3.81,0; 2 -1.27,0; 3 1.27,0; 4 3.81,0
SON50P200X300X80-13N = smd 0.66 x 0.305: 1 -1.016,1.245; 2 -1.016,0.762; 3 -1.016,0.254; 4 -1.016,-0.254; 5 -1.016,-0.762; 6 -1.016,-1.245; 7 1.016,-1.245; 8 1.016,-0.762; 9 1.016,-0.254; 10 1.016,0.254; 11 1.016,0.762; 12 1.016,1.245 | smd 0.991 x 3.099: 13 0,0
S-PVSON-N10 = smd 0.28 x 0.825: 1 -1,-1.462; 2 -0.5,-1.462; 3 0,-1.462; 4 0.5,-1.462; 5 1,-1.462; 6 1,1.462; 7 0.5,1.462; 8 0,1.462; 9 -0.5,1.462; 10 -1,1.462 | smd 2.15 x 1.6: EXPAD 0,0 | hole 0.3: -0.75,0.5; 0.75,0.5; 0.75,-0.5; -0.75,-0.5; 0,0
STAR = smd 0.152 x 0.305: AGND 0.635,-0.635; DGND 0.635,0.635 | smd 0.305 x 0.152: GND 0.635,0
SOIC_8-LEAD = smd 0.61 x 2.21: CE -1.905,-2.934; RST/HOLD -0.635,5.156; SCK 0.635,5.156; SI 1.905,5.156; SO -0.635,-2.934; VDD -1.905,5.156; VSS 1.905,-2.934; WP 0.635,-2.934
HX1 = drill 1.016 long: 0V 13.97,0; EN 8.89,0; RFGND -13.97,0; RFGND2 -8.89,0; RFOUT -11.43,0; TXD 16.51,0; VCC 11.43,0

### Placement (x,y rotation side)
C1  57.47,18.73 315 top
C2  30.16,36.31 0 top
C3  9.37,7.78 270 top
C4  15.08,9.37 0 top
C5  14.9,6.51 90 top
C6  16.66,6.51 90 top
C7  18.26,6.51 90 top
C8  50.22,5.18 270 top
C9  55.24,16.51 135 top
C10  63.69,8.95 180 top
C11  47.35,34.01 270 top
C13  66.59,8.79 270 top
C15  64.38,1.33 0 top
C16  19.79,20.24 180 top
C17  19.84,18.31 180 top
C18  33.45,16.31 315 top
C19  31.52,13.21 315 top
C20  19.79,21.97 0 top
C21  11.76,21.32 90 top
C22  52.7,13.97 135 top
C23  38.42,30.16 135 top
C25  34.62,17.58 315 top
C26  40.16,5.18 270 top
C27  29.85,5.18 270 top
C28  21.87,6.3 0 top
C29  12.2,25.6 90 top
C30  33.5,13.82 315 top
COMPASS  64.45,5.29 90 top
GPIO1  55.24,40 0 top
GPIO2  67.31,25.4 270 top
GREEN  22.96,12.27 270 top
IC1  9.44,24.38 270 top
JP1  26.82,19.14 45 top
JP3  19.84,34.61 180 top
JP4  4.36,9.68 270 top
JP5  4.34,21.13 270 top
L1  9.37,3.33 0 top
L3  37.46,13.97 315 top
LED0  7.29,28.52 90 top
LED1  7.32,29.92 90 top
MPU-6050  15.39,20.02 90 top
MSP1  45.09,21.59 45 top
Q2  56.52,12.7 225 top
R2  10.64,10.95 180 top
R3  17.2,2.03 270 top
R4  26.09,12.12 180 top
R6  15.24,2.05 270 top
R7  37.46,29.21 135 top
R8  3.35,28.35 0 top
R9  3.33,29.92 0 top
R10  56.52,17.78 315 top
R16  12.99,30.26 270 top
RED  13.25,2.2 180 top
RPUC  3.33,24.74 180 top
RPUD  3.33,26.44 180 top
SJ1  22.68,6.32 0 bottom
SJ2  1.59,40.64 180 bottom
SV1  24.54,1.88 0 top
SV2  34.7,1.88 0 top
SV3  44.86,1.91 0 top
SV4  55.02,1.91 0 top
U3  25.48,5.66 90 top
U4  35.66,5.66 90 top
U5  45.8,5.71 90 top
U7  55.98,5.69 90 top
U$1  11.91,7.78 0 top
U$2  5.61,14.05 90 top
U$3  19.16,29.26 270 top
U$4  18.62,39.87 0 top

### Tracks (layer width: path | path; a pad name or v marks a point on that pad's centre or on a via)
5VEN  (via drill 0.3)
  Top 0.254: U$1.9 11.41,10.95 R2.1 11.49,11.2 v12.57,11.2 | 14.86,12.27 v14.76,12.22 21.37,12.22 21.37,10.24 30.56,10.24 v31.32,11 | MSP1.17 38.14,11.81 v36.4,12.12
  Bottom 0.254: v14.76,12.22 12.57,12.27 v12.57,11.2 | v36.4,12.12 35.43,11 v31.32,11
+3V3  (via drill 0.3, 0.6)
  Top 0.254: C3.1 U$1.10 | R2.2 9.79,10.79 8.26,10.79 | GREEN.A 22.21,13.93 22.17,13.97 | MSP1.13 36.65,13.16 34.79,13.16 arc90 C30.+ | U$3.RST/HOLD 24.31,31.22 25.02,31.93 v25.02,32.54 | v29.39,31.32 | v29.39,31.32 32.93,27.77 | JP1.7 34.81,27.62 33.8,28.63 | R7.2 36.58,30.1 35.38,30.1 | MSP1.73 47.8,31.38 47.8,32.6 C11.2 | 32.36,12.85 arc90 C19.2 | 13.19,24.76 13.33,24.9 13.33,28.58 12.99,28.92 R16.2
  Top 0.305: U$3.RST/HOLD U$3.VDD | C20.1 16.69,21.97 MPU-6050.13 18.82,22.02 18.82,24.75 16.17,24.75 16.17,24.76 13.19,24.76 | C17.2 18.04,19.27 MPU-6050.8 | MPU-6050.8 17.38,19.28 | COMPASS.4 65.2,2.83 | 65.2,2.83 65.2,1.35 C15.2 68.05,1.33 68.05,10.79 66.27,10.79 v60.58,16.48 | COMPASS.2 64.2,2.95 v64.38,2.78 | v61.79,5.97 61.79,6.04 COMPASS.13 | v64.33,2.78 64.33,2.83 65.2,2.83 | 2.46,26.44 RPUD.2 2.27,26.65 1.5,26.65 | RPUC.2 2.48,24.5 2.08,24.74 1.5,24.74 | IC1.6 9.66,24.71 9.03,24.08 8.43,24.08 IC1.2 | IC1.8 11.62,23.41 11.62,24.71 | 24.18,19.38 24.44,19.13 | MPU-6050.8 24.44,19.27 24.44,19.03 | v49.86,24.21 v46.3,27.76
  Top 0.406: C20.1 19.03,22.06 | IC1.6 11.62,24.71 11.96,24.71 C29.1 18.82,24.75 21.53,24.75 22.78,23.5 22.78,20.78 24.18,19.38 24.18,19.36 24.26,19.28 | 35.38,30.1 37.11,31.83 v37.11,32.03 | v44.22,33.35 v46.2,33.35 47.36,33.35 C11.2 | C19.2 28.99,12.61 27.62,13.97 24.44,13.97 | 32.36,12.85 C30.+
  Top 0.61: v23.5,9.21 20.32,9.21 20.32,11.11 13.58,11.11 13.58,12.38 8.26,12.38 8.26,10.79 8.26,8.63 7.62,8.63 | 6.98,8.89 7.62,8.89 7.62,13.97 22.17,13.97 24.44,13.97 24.44,19.03 24.44,19.13 24.44,19.25 32.93,27.77 33.8,28.63 35.28,30.1 36.07,30.2 R7.2 | 1.5,21.67 1.5,10.77 2.28,9.68 JP4.7 | 1.5,26.65 1.5,24.74 1.5,21.67 | JP5.1 1.6,22.4 1.5,21.67
  Top 1.422: C3.1 7.62,8.63 7.14,8.63 7.14,8.41 4.92,9.05 4.92,9.37
  Bottom 0.254: v25.02,32.54 28.17,32.54 v29.39,31.32
  Bottom 0.305: v64.38,2.78 v64.33,2.78 | v60.58,16.48 60.48,18.16 54.48,24.16 v49.86,24.21 | v46.3,27.76 46.2,27.86 46.25,27.86 49.25,30.86 46.76,33.35 v46.2,33.35
  Bottom 0.406: v61.79,5.97 61.79,3.23 62.24,2.78 v64.38,2.78 | v37.11,32.03 38.02,32.94 39.04,32.74 40.87,30.91 41.99,31.12 v44.22,33.35
  Bottom 0.61: SJ1.1 23.75,8.26 v23.5,9.21
  pour Top: 0.48,10.95 8.1,10.95 6.83,5.87 0.48,5.87
  pour Top (no thermals): 8.1,1.75 8.1,9.05 6.83,9.68 6.83,3.02
+5V  (via drill 0.3, 0.6)
  Top 0.254: U$1.7 12.41,10.32 17.78,10.32 v20.32,7.94 | 12.12,1.37 12.17,2.95 RED.A
  Top 0.305: R3.2 18.61,1.18 18.61,5.3
  Top 0.406: v27.71,37.46 29.07,36.35 C2.1
  Top 0.61: JP4.13 JP4.14 5.63,0.64 12.12,0.64 12.12,1.37 12.12,4.76 | C7.1 18.61,5.3 19.37,4.55 v19.89,4.55
  Bottom 0.254: v20.32,7.94 20.32,6.67 20.7,6.67 SJ1.3
  Bottom 0.406: 28.58,37.46 28.58,37.41 v27.71,37.46
  Bottom 0.61: JP4.13 arc90 2.62,2.54 1.27,3.81 1.27,36.2 2.36,37.34 10.94,37.34 13.02,40 23.81,40 26.35,37.46 28.58,37.46 30.05,38.94 U$4.VCC | v19.89,4.55 21.16,5.82 SJ1.3
  pour Top (no thermals): 18.89,6.03 13.97,6.03 13.97,5.08 12.38,5.08 12.38,6.51 11.91,6.51 11.91,4.29 18.89,4.29
A14
  Top 0.254: GPIO2.7 64.26,22.86 61.04,26.09 55.22,26.09 MSP1.55
A15
  Top 0.254: MSP1.54 55.18,25.32 59.87,25.32 64.75,20.45 67.18,20.45 GPIO2.8
A16
  Top 0.254: GPIO2.9 65.84,17.78 65.76,17.7 58.85,24.61 55.18,24.61 MSP1.53
A17
  Top 0.254: GPIO2.10 67.18,15.11 65.86,15.11 56.87,24.11 55.39,24.11 MSP1.52
A18
  Top 0.254: GPIO2.11 65.94,12.7 55.9,22.74 MSP1.51
AGND  (via drill 0.3)
  Top 0.254: MSP1.40 49.85,18.23 v49.85,19.05 51.46,18.73 MSP1.43 | MSP1.84 40,29.51 v40,30.16
  Top 0.305: R10.2 57.2,17.09 v58.24,17.09 58.24,17.96 C1.2
  Top 0.406: v51.75,20.64 48.26,20.64 v42.23,26.67 | C23.2 37.96,30.66 v38.73,31.43
  Top 0.61: v23.19,18.11 23.19,15.06 6.63,15.06 arc90 U$2.AGND
  Bottom 0.254: v49.85,19.05 50.48,19.05 | v40,30.16 39.37,30.8 39.05,30.8
  Bottom 0.305: v58.24,17.09 58.45,17.09
  Bottom 0.406: 50.48,19.05 51.75,20.32 v51.75,20.64 | v42.23,26.67 41.91,26.99 | v38.73,31.43 38.73,31.12 39.05,30.8
  Bottom 0.61: v23.19,18.11 35.18,30.1 36.7,30.1 37.31,29.49
  pour Bottom: 53.98,23.5 60.01,17.78 58.42,16.19 51.75,16.51 49.21,18.73
  pour Bottom: 38.42,32.07 43.18,27.31 41.59,25.72 37.78,27.31 35.56,29.21
AVCC1
  Top 0.254: C1.1 55.39,19.19 54.29,18.1 53.53,18.1 MSP1.45 51.95,19.69 47.71,19.69 MSP1.87 38.88,28.52 38.88,28.58 | 38.88,28.58 C23.1 | R7.1 38.1,28.58 38.88,28.58
GND  (via drill 0.3)
  Top 0.203: 57.25,4.72 U7.6 | 26.7,5.61 25.48,5.61 U3.13 | 46.96,5.64 45.9,5.64 U5.13 | 56.03,5.64 U7.13 | COMPASS.9 65.2,7.33 v65.55,7.68
  Top 0.254: v38.65,5.69 37.06,5.69 arc90 36.91,5.54 U4.6 | U5.6 47.04,5.56 arc90 46.96,5.64 | U7.6 57.23,5.7 arc-90 57.24,5.71 56.01,5.71 arc90 U7.13 | U3.6 26.72,5.59 arc90 26.7,5.61 | C4.2 16.35,9.37 C6.2 | v9.21,6.03 9.21,6.98 | R6.1 15.24,3.89 v14.2,3.89 | 14.14,18.51 14.4,18.77 | MPU-6050.18 14.19,21.41 14.5,21.21 | MSP1.82 42.85,28.07 v44.93,28.07 | MSP1.72 45.41,28.27 45.03,27.96 v44.93,28.07 | 44.83,28.17 v44.93,28.07 | C11.1 47.33,34.91 v46.25,35.08 | MSP1.15 v41.99,17.09 | C18.1 31.34,18.42 v29.85,18.42 | C25.- 32.85,17.75 C18.1 | C18.1 32.53,16.59 C30.-
  Top 0.305: C28.1 20.6,6.72 C7.2 | COMPASS.11 64.2,7.73 v64.22,7.8 | 65.56,7.69 v65.55,7.68 | MPU-6050.18 14.14,22.84 v13.23,22.84 13.19,22.68 C21.2 | C10.2 62,8.97 v61.58,9.07 | MPU-6050.1 14.14,18.51 | 14.4,18.77 14.4,19.03 MPU-6050.P 15.85,20.02 15.88,19.99 | MPU-6050.9 15.9,19.77 15.88,19.79 15.88,19.99 | 15.88,19.99 15.88,20.7 | 15.88,20.7 15.88,20.77 MPU-6050.11 | 14.5,21.21 15.37,21.21 15.88,20.7 | C20.2 C16.1 20.64,21.04 20.65,21.06 v21.92,21.06 | C17.1 21.92,18.31 v21.97,18.26 | C15.1 63.58,1.3 v61.84,1.3 | IC1.5 10.46,26.31 v11.16,26.31 12.25,26.31 C29.2 | IC1.1 8.41,22.76 v9.28,22.76 9.28,23.27 10.08,24.06 IC1.7 | U$3.VSS 18.82,27.36 v18.82,28.07 | C22.1 C9.1 58.45,13.31 58.45,12.93 57.43,11.92 Q2.P3 | Q2.P3 56.55,10.9 56.11,10.69 53.36,13.44 53.26,13.64 | Q2.P3 58.53,12.88 v59.31,12.88 | C30.- 31.9,14.79 C19.1 29.37,13.81 v29.21,13.97 | R4.1 28.21,12.12 v28.26,12.06 | R9.1 2.48,28.37 R8.1 2.5,31.08 v2.86,31.43
  Top 0.406: U$4.0V 32.59,37.26 C2.2
  Top 0.61: JP4.4 arc90 5.61,14.74 U$2.GND U$2.DGND
  Top 0.813: JP4.4 JP4.3 | JP4.6 JP4.5
  Bottom 0.254: v14.2,3.89 14.35,4.09 14.4,4.09 | v44.93,28.07 44.73,28.27 45.03,28.27 | v46.25,35.08 46.05,35.08 45.44,35.69 | v41.99,17.09 42.34,16.74 42.34,16.69 | v29.85,18.42 29.85,17.15
  Bottom 0.305: v64.22,7.8 64.07,7.7 64.43,7.65 | v13.23,22.84 12.98,22.84 | v21.92,21.06 21.46,21.21 | v21.97,18.26 22.17,18.26 22.23,18.21 | v61.84,1.3 61.73,1.5 61.63,1.76 | v11.16,26.31 11.32,26.52 11.37,26.52 | v9.28,22.76 9.28,22.5 9.38,22.5 | v18.82,28.07 19.33,28.07 19.33,27.76 | v59.31,12.88 59.46,13.03 60.48,13.03 | v29.21,13.97 27.31,14.61 | v28.26,12.06 29.85,12.06 | v2.86,31.43 3.81,31.43
  other vias: 28.08,5.69 33.06,5.69 31.66,5.69 41.9,5.69 48.89,5.71 53.4,5.71 51.55,5.71 15.24,8.26 17.15,8.26 58.43,5.77
  pour Bottom (isolate 0.254, rank 2): -0.74,41.99 69.49,41.91 69.75,-0.48 0,-0.48
  pour Top (no thermals): 9.05,7.46 10,7.46 10.95,8.41 18.89,8.41 18.89,6.83 13.81,6.83 12.86,7.14 10.64,7.14 9.68,6.51 9.05,6.51
  pour Top (no thermals): 23.95,5.37 58.92,5.4 58.94,6.03 23.95,6.01
HX1_EN  (via drill 0.3)
  Top 0.254: MSP1.70 49.21,30.68 49.21,35.56 46.99,37.46 v40.64,37.46 | v38.73,36.2 v33.02,36.2 | v31.12,37.46 29.21,37.46 27.51,39.17 U$4.EN
  Bottom 0.254: v40.64,37.46 39.37,36.2 v38.73,36.2 | v33.02,36.2 31.75,37.46 v31.12,37.46
IND
  pour Top (no thermals): 11.43,6.51 11.43,1.75 10.16,1.75 10.16,5.24 10.79,6.51
LED0  (via drill 0.3)
  Top 0.254: MSP1.75 45.54,31.91 v45.54,32.13 | v30.05,32.33 30.1,32.38 34.92,32.38 35.48,31.83 v35.48,31.5 | v12.83,37.31 11.11,35.6 11.11,29.85 9.79,28.52 LED0.A
  Bottom 0.254: v45.54,32.13 45.19,32.49 45.19,34.21 44.98,34.42 43.66,34.42 41.33,32.08 40.87,32.08 39.19,33.76 37.11,33.76 v35.48,31.5 | v30.05,32.33 25.07,37.31 v12.83,37.31
LED1  (via drill 0.3)
  Top 0.254: MSP1.71 48.26,30.41 48.26,35.56 46.67,36.83 44.45,36.83 v42.54,34.92 | v30.48,27.94 27.94,25.4 v14.61,25.4 | v9.53,29.85 9.45,29.92 LED1.A
  Bottom 0.254: v42.54,34.92 41.91,34.29 36.83,34.29 v30.48,27.94 | v14.61,25.4 10.16,29.85 v9.53,29.85
M1IN1
  Top 0.254: U3.10 25.22,9.14 33.3,9.14 33.3,10.77 38.5,10.77 MSP1.19
M1IN2
  Top 0.254: U3.9 25.73,8.64 33.76,8.64 33.76,10.31 38.77,10.31 MSP1.20
M2IN1
  Top 0.254: U3.8 26.24,8.13 33.66,8.08 34.21,8.08 34.21,9.86 38.99,9.86 MSP1.21
M2IN2
  Top 0.254: U3.7 26.72,7.62 34.72,7.62 34.72,9.4 39.25,9.4 MSP1.22
M3IN1
  Top 0.254: U4.10 arc90 35.41,6.73 35.41,8.94 39.51,8.94 MSP1.23
M3IN2
  Top 0.254: U4.9 35.92,8.43 39.72,8.43 MSP1.24
M4IN1
  Top 0.254: U4.8 36.42,7.87 39.85,7.87 MSP1.25
M4IN2
  Top 0.254: U4.7 36.93,6.68 36.91,7.39 41.66,7.39 MSP1.26
M5IN1
  Top 0.254: U5.10 45.54,9.35 47.31,11.11 47.31,11.57 MSP1.27
M5IN2
  Top 0.254: MSP1.28 47.78,11.81 47.78,10.95 46.04,9.21 46.04,6.74 U5.9
M6IN1
  Top 0.254: MSP1.29 48.26,12.06 48.26,10.79 46.56,9.09 U5.8
M6IN2
  Top 0.254: 47.07,6.73 U5.7 47.04,8.94 48.74,10.64 48.74,12.3 MSP1.30
M7IN1  (via drill 0.3)
  Top 0.254: U7.10 55.73,7.87 55.35,8.26 v53.98,8.26 | v53.98,9.53 52.91,9.53 MSP1.32
  Bottom 0.254: v53.98,8.26 v53.98,9.53
M7IN2
  Top 0.254: MSP1.31 52.83,8.89 55.24,8.89 56.24,8.22 U7.9
M8IN1
  Top 0.254: MSP1.33 52.68,10.48 53.98,10.48 55.16,9.84 56.74,8.66 U7.8
M8IN2
  Top 0.254: MSP1.46 53.27,19.02 52.35,19.94 53.98,21.57 56.11,21.57 59.56,18.11 59.56,14.4 61.19,12.78 59.97,11.51 57.23,8.76 U7.7
M1234SLEEP  (via drill 0.3)
  Top 0.254: U3.12 U3.11 24.71,9.55 arc-90 24.79,9.65 32.74,9.65 v32.59,9.86 32.69,10.36 32.79,10.46 32.79,11.25 38.27,11.25 MSP1.18 | U4.12 v32.54,6.71
  Top 0.305: U4.11 U4.12
  Bottom 0.254: v32.54,6.71 32.54,9.7 arc-90 v32.59,9.86
M5678SLEEP  (via drill 0.3)
  Top 0.254: 48.13,7.42 48.13,6.71 v48.18,6.71 48.18,7.42 52.7,7.42 | U5.11 U5.12 44.04,6.71 v43.56,6.71 | 52.7,7.42 54.74,7.42 U7.12 U7.11 | MSP1.34 52.41,11.43 v52.7,11.43 | v52.7,8.26 52.7,7.42
  Bottom 0.254: v48.18,6.71 v43.56,6.71 | v52.7,11.43 v52.7,8.26
N$1
  Top 0.254: MSP1.12 38.02,15.24
  Top 0.305: 38.02,15.24 37.46,15.24 | 37.46,15.24 36.86,14.63 L3.1 | 37.46,15.24 36.96,15.24 C25.+ 34.95,16.61 C18.2
N$2  (via drill 0.3)
  Top 0.254: U$1.5 12.96,6.38 v13.54,6.38 | v16.23,3.79 17.2,3.79 R3.1
  Bottom 0.254: v13.54,6.38 16.23,6.38 v16.23,3.79
N$4
  Top 0.254: GREEN.C 25.08,12.27 R4.2
N$5
  Top 0.254: 4.38,28.52 R8.2
  Top 0.305: 4.38,28.52 LED0.C
N$6
  Top 0.305: LED1.C R9.2
N$7
  cutout Bottom: 51.43,14.29 52.07,14.92 52.07,16.19 50.8,17.46 50.8,18.1 51.43,18.73 52.07,18.73 53.34,17.46 54.61,17.78 56.2,16.19 56.2,14.61 59.37,11.43 57.78,9.84 54.29,13.33 53.02,13.02
N$8
  Top 0.254: MSP1.41 53.05,15.74 Q2.P2
  Top 0.305: C22.2 53.05,15.23 Q2.P2
N$10
  Top 0.254: MSP1.42 53.35,16.16 Q2.P1
  Top 0.305: C9.2 53.98,16.16 Q2.P1
N$13
  Top 0.254: U4.2 34.9,3.89 34.52,3.89 arc23 31.52,3.28 arc85 SV2.1
N$14
  Top 0.254: GPIO2.1 65.73,38.1 64.44,36.8 64.44,34.21 60.83,30.61 55.5,30.61 MSP1.61
N$15
  Top 0.254: GPIO2.2 66.7,35.56 61.19,30.05 55.66,30.05 MSP1.60
N$16
  Top 0.305: 34.87,3.86 33.32,3.76 | 33.32,3.76 32.08,3.5 30.53,1.75 | 33.32,3.76 30.71,3.2 32.03,3.5 30.76,2.44 31.62,3.1 30.81,2.29
N$17
  Top 0.203: COMPASS.10 64.76,6.84 64.76,7.55 64.94,7.93 64.94,8.95 C10.1
N$18
  Top 0.305: C16.2 18.92,20.27 MPU-6050.10
N$19
  Top 0.305: MPU-6050.20 11.79,20.77 C21.1
N$20
  Top 0.254: GPIO2.3 65.23,33.02 61.7,29.49 55.82,29.49 MSP1.59
N$21
  Top 0.254: GPIO2.4 63.8,30.48 62.31,28.88 56,28.88 MSP1.58
N$22
  Top 0.254: GPIO2.5 55.67,27.94 MSP1.57
N$23
  Top 0.254: GPIO2.6 62.94,25.4 61.24,27.1 55.55,27.1 MSP1.56
N$25
  Top 0.203: C13.2 66.59,6.67 COMPASS.8
N$27
  Top 0.254: MSP1.69 49.76,30.5 49.76,35.8 46.35,39.2 | 46.35,38.68 46.35,39.2 | 46.35,39.2 GPIO1.1
N$28
  Top 0.254: GPIO1.2 48.89,37.79 50.63,36.05 50.63,30.66 MSP1.68
N$30
  Top 0.254: GPIO1.3 51.43,30.78 MSP1.67
N$32
  Top 0.203: C13.1 arc90 66.34,9.89 63.68,9.89 63.66,8.13 63.59,7.96 63.59,7.32 COMPASS.12
N$33
  Top 0.254: R10.1 55.07,18.24 54.29,17.46 53.45,17.46 MSP1.44
N$34
  Top 0.254: MSP1.14 38.73,14.52
  Top 0.305: 38.73,14.52 38.73,13.97 38.13,13.37 L3.2
N$35
  Top 0.254: GPIO1.4 53.98,38.18 51.99,36.2 51.99,30.62 MSP1.66
N$36
  Top 0.254: GPIO1.5 56.52,38.12 52.65,34.27 52.65,30.56 MSP1.65
N$37
  Top 0.254: GPIO1.6 58.75,39.7 58.75,38.58 53.26,33.1 53.26,30.51 50.11,27.36 MSP1.64
N$38
  Top 0.254: GPIO1.8 64.14,38.84 63.02,37.72 60.78,37.72 54.38,31.32 54.38,30.2 50.83,26.65 MSP1.62
N$39
  Top 0.305: U4.3 35.41,3.73 35.25,3.43 33.63,2.56 SV2.2
N$40
  Top 0.305: SV2.3 35.97,1.7 U4.4
N$41
  Top 0.305: SV2.4 38.41,2.82 36.52,3.94 36.42,4.04 U4.5
N$42
  Top 0.254: U$1.6 14.23,9.24 C4.1
N$43
  Top 0.254: GPIO1.7 53.77,32.18 53.77,30.28 MSP1.63
N$44
  Top 0.254: RED.C 13.51,1.2 R6.2
N$45
  Top 0.305: U5.2 45.03,3.91 42.85,3.66 41.02,2.74 SV3.1
N$46
  Top 0.305: U5.3 45.54,3.71 45.39,3.5 43.92,2.79 SV3.2
N$47
  Top 0.305: U5.4 SV3.3
N$48
  Top 0.305: U5.5 46.56,4.12 48.64,2.74 SV3.4
N$49
  Top 0.305: U3.2 24.71,3.94 23.52,3.89 | 23.52,3.89 22.28,3.63 SV1.1 | 23.52,3.89 20.6,3.23 22.23,3.63 20.19,2.41 21.82,3.23 21.01,2.41
N$50
  Top 0.305: U3.3 25.22,3.79 25.12,3.58 24.77,3.38 | 24.77,3.38 23.44,2.41 23.44,2.82 | 23.44,2.82 23.44,3.23 24.77,3.38 | 24.77,3.38 23.44,2.82 | 23.44,2.82 SV1.2
N$51
  Top 0.305: U3.4 25.73,4.04 | 25.73,4.04 25.73,2.82 25.48,2.82 25.68,3.43 | 25.68,3.43 25.88,3.63 | 25.88,3.63 25.73,4.04 | 25.73,4.04 26.29,2.82 25.88,2.82 25.88,3.63 | 25.73,4.04 25.68,3.43 | 25.68,3.43 SV1.3
N$52
  Top 0.305: U3.5 26.24,4.14 27.71,3.02 26.34,4.04 27.86,3.25 27.41,3.38 SV1.4
N$53
  Top 0.305: U7.2 55.22,3.96 53.24,3.68 51.66,3 SV4.1
N$54
  Top 0.305: U7.3 55.73,3.71 55.02,3.15 SV4.2
N$55
  Top 0.305: U7.4 SV4.3
N$56
  Top 0.305: U7.5 56.74,4.12 58.93,2.69 SV4.4
N$57
  Top 0.305: 22.99,3.79 20.4,2.46 20.19,2.82
N$59
  Top 0.305: 35.41,4.55 35.41,3.68 35.31,3.48 34.95,3.28 | 34.95,3.28 33.63,2.31 33.63,2.72 | 33.63,2.72 33.63,3.12 34.95,3.28 | 34.95,3.28 33.63,2.72 | 33.63,2.72 33.45,1.78
N$60
  Top 0.305: 35.92,4.55 35.92,3.94 | 35.92,3.94 35.92,2.72 35.66,2.72 35.86,3.33 | 35.86,3.33 36.07,3.53 | 36.07,3.53 35.92,3.94 | 35.92,3.94 36.47,2.72 36.07,2.72 36.07,3.53 | 35.92,3.94 35.86,3.33 | 35.86,3.33 35.99,1.78
N$61
  Top 0.305: 36.42,4.55 36.42,4.04 37.9,2.92 36.52,3.94 38.51,3.12 37.59,3.28 38.53,1.78
N$63
  Top 0.305: 45.03,4.62 45.03,3.91 43.87,3.81 | 43.87,3.81 42.6,3.61 41.05,1.85 | 43.87,3.81 40.92,3.2 42.54,3.61 40.51,2.39 42.14,3.2 41.33,2.39
N$64
  Top 0.305: 45.54,4.62 45.54,3.76 45.44,3.56 45.09,3.35 | 45.09,3.35 43.76,2.39 43.76,2.79 | 43.76,2.79 43.76,3.2 45.09,3.35 | 45.09,3.35 43.76,2.79 | 43.76,2.79 43.59,1.85
N$65
  Top 0.305: 46.05,4.62 46.05,4.01 | 46.05,4.01 46.05,2.79 45.8,2.79 46,3.4 | 46,3.4 46.2,3.61 | 46.2,3.61 46.05,4.01 | 46.05,4.01 46.61,2.79 46.2,2.79 46.2,3.61 | 46.05,4.01 46,3.4 | 46,3.4 46.13,1.85
N$66
  Top 0.305: 46.56,4.62 46.56,4.12 48.03,3 46.66,4.01 48.64,3.2 47.73,3.35 48.67,1.85
N$67
  Top 0.305: 43.31,3.76 40.72,2.44 40.51,2.79
N$68
  Top 0.305: 55.22,4.57 55.22,3.91 54.05,3.81 | 54.05,3.81 52.78,3.61 51.23,1.85 | 54.05,3.81 51.1,3.2 52.73,3.61 50.7,2.39 52.32,3.2 51.51,2.39
N$69
  Top 0.305: 55.73,4.62 55.73,3.76 55.63,3.56 55.27,3.35 | 55.27,3.35 53.95,2.39 53.95,2.79 | 53.95,2.79 53.95,3.2 55.27,3.35 | 55.27,3.35 53.95,2.79 | 53.95,2.79 53.77,1.85
N$70
  Top 0.305: 56.24,4.62 56.24,4.01 | 56.24,4.01 56.24,2.79 55.98,2.79 56.18,3.4 | 56.18,3.4 56.39,3.61 | 56.39,3.61 56.24,4.01 | 56.24,4.01 56.79,2.79 56.39,2.79 56.39,3.61 | 56.24,4.01 56.18,3.4 | 56.18,3.4 56.31,1.85
N$71
  Top 0.305: 56.74,4.62 56.74,4.12 58.22,3 56.84,4.01 58.83,3.2 57.91,3.35 58.85,1.85
N$72
  Top 0.305: 53.24,3.68 50.9,2.44 50.7,2.79
N$75  (via drill 0.3)
  Top 0.254: MSP1.83 43.45,26.75 v43.61,26.75
  Bottom 0.254: v43.61,26.75 41.88,25.02 37.01,26.95 33.35,23.29 32.57,23.29 JP1.4
N$76
  Top 0.254: MSP1.94 36.63,25.8 JP1.6
N$77
  Top 0.254: MSP1.95 36.5,25.22 35.99,25.22 35.16,24.39 JP1.5
RFGND
  Top 0.61: U$4.RFGND 4.65,37.26 9.73,37.26 U$4.RFGND2
  Bottom 0.61: SJ2.2 3.12,39.87 U$4.RFGND
RX
  Top 0.254: MSP1.6 38.12,19.59 38.12,20.04 36.6,21.57 32.74,21.57 29.59,21.66 JP1.2
SCL  (via drill 0.3)
  Top 0.254: COMPASS.1 62,3.79 v57.99,7.8 | v46.81,16.54 45.24,18.11 v40.66,18.11
  Top 0.305: RPUD.1 5.58,25.04 | 5.58,25.04 6.93,23.69 6.93,21.34 5.61,20.02 JP5.4 5.61,17.31 5.84,17.31 JP4.2 10.79,17.3 | v21.27,16.94 13.18,16.94 11.61,16.99 10.79,17.3 | MPU-6050.23 10.79,19.27 10.79,17.3 | IC1.4 7.17,25.36 5.58,25.04 | v25.63,16.89 30.81,15.57 v30.71,15.47 | v40.66,18.11 40.2,18.11 MSP1.11
  Bottom 0.254: v57.99,7.8 53.72,12.06 52.35,12.06 48.59,15.82 47.52,15.82 v46.81,16.54
  Bottom 0.305: v21.27,16.94 25.58,16.94 v25.63,16.89 | v30.71,15.47 38.12,15.47 v40.66,18.11
SDA  (via drill 0.3)
  Top 0.254: RPUC.1 3.01,26.23 3.01,26.49 | COMPASS.16 62.16,4.54 v58.14,8.56 | v47.62,17.45 46.2,19.03 v39.75,19.03
  Top 0.305: IC1.3 7.68,24.55 v7.4,24.44 | v5.61,23.9 4.38,23.9 arc-90 RPUC.1 4.34,23.94 4.34,21.13 JP5.3 3.07,17.36 3,17.36 JP4.1 4.39,16 10.11,16 v10.39,16.28 10.72,15.95 v21.99,15.95 | MPU-6050.24 12.01,18.77 v12.01,18.01 | v27.36,17.2 v31.52,16.28 | v39.75,19.03 39.75,18.38 MSP1.10
  Bottom 0.254: v58.14,8.56 54.03,12.67 52.55,12.67 v47.62,17.45
  Bottom 0.305: v7.4,24.44 5.92,23.9 v5.61,23.9 | v12.01,18.01 12.01,17.68 11.65,17.37 | 11.65,17.37 v10.39,16.28 10.57,16.28 11.65,17.37 | v21.99,15.95 26.11,15.95 v27.36,17.2 | v31.52,16.28 37.01,16.28 v39.75,19.03
SPI_EXTSLAVE_TE
  Top 0.254: MSP1.76 39.87,35.28 27.56,35.28 25.93,36.91 22.38,36.91 21.11,35.64 JP3.2
SPI_FLASH_CS
  Top 0.254: MSP1.80 39.27,33.04 28.27,33.04 27.76,32.54 27.76,27.56 26.34,26.04 15.37,26.04 14.05,27.36 14.05,29.9 14.15,30 | 14.15,30 15.37,31.22 16.17,31.22 U$3.CE | R16.1 13.03,31.11 14.15,30
SPI_MISO
  Top 0.254: MSP1.79 39.38,33.66 28.07,33.66 27.25,32.84 27.25,27.76 26.04,26.54 22.48,26.54 19.13,29.9 | 19.13,29.9 U$3.SO | JP3.4 16.03,33.5 18.21,31.32 18.21,30.71 19.13,29.9
SPI_MOSI
  Top 0.254: MSP1.78 39.49,34.27 27.96,34.27 26.75,33.04 26.75,28.47 25.63,27.36 U$3.SI 22.78,27.36 19.03,31.12 19.03,34.16 JP3.3
SPI_SCK
  Top 0.254: MSP1.77 39.7,34.77 27.66,34.77 26.14,33.25 26.14,28.98 25.78,28.63 U$3.SCK 24.26,28.68 22.58,28.68 22.58,33.53 JP3.1
TX  (via drill 0.3)
  Top 0.254: MSP1.7 36.86,17.6 36.5,17.5 33.76,20.14 33.45,20.45 | 33.45,20.45 33.35,20.55 JP1.3 | 33.45,20.45 33.35,20.55 v31.12,20.55 | v44.32,32.03 43.51,32.84 40.36,36.09 38.91,37.21 U$4.TXD
  Bottom 0.254: v31.12,20.55 31.73,20.55 37.11,25.93 41.78,24.21 42.19,24.21 44.32,26.34 44.32,27.15 42.8,28.68 42.8,30.51 v44.32,32.03
V_MOTOR  (via drill 0.3)
  Top 0.254: U7.1 54.74,4.76 52.45,4.76 v52.45,4.75 51.56,4.75 51.56,4.33 C8.2 | C28.2 22.72,6.33 | v32.41,4.43 32.31,4.33 C27.2 | v43.5,4.76 arc-90 43.48,4.75 41.55,4.75 41.55,4.33 C26.2
  Top 0.305: U4.1 34.42,4.74 v32.41,4.43 | U5.1 44.55,4.76 v43.5,4.76 | C28.2 22.68,6.26 22.68,4.77 v22.81,4.65 U3.1
  Bottom 0.254: v52.45,4.75 51.56,4.75 51.56,4.14 49.85,4.14 49.85,4.13
  Bottom 0.305: 22.61,4.69 23,4.1 | v32.41,4.43 33.25,4.1 | v43.5,4.76 43.5,4.13 | SJ1.2 22.81,6.2 v22.81,4.65
  Bottom 0.61: SJ1.2 22.68,4.1 23,4.1 33.25,4.1 33.57,4.1 43.5,4.13 49.85,4.13

### Text on the board
tValues: MISO MOSI TE CLK | Octanis 1 v0.4 | octanis.org | SCL | GND | HMC5883L | 5V |GND| 3.3V | GND | SDA | 3.3V
bValues: 3V3 V_mot 5V